# EAGLE design Speedy V2.1 (EAGLE 9.5.2)

## Sheet 1 of 4: Power
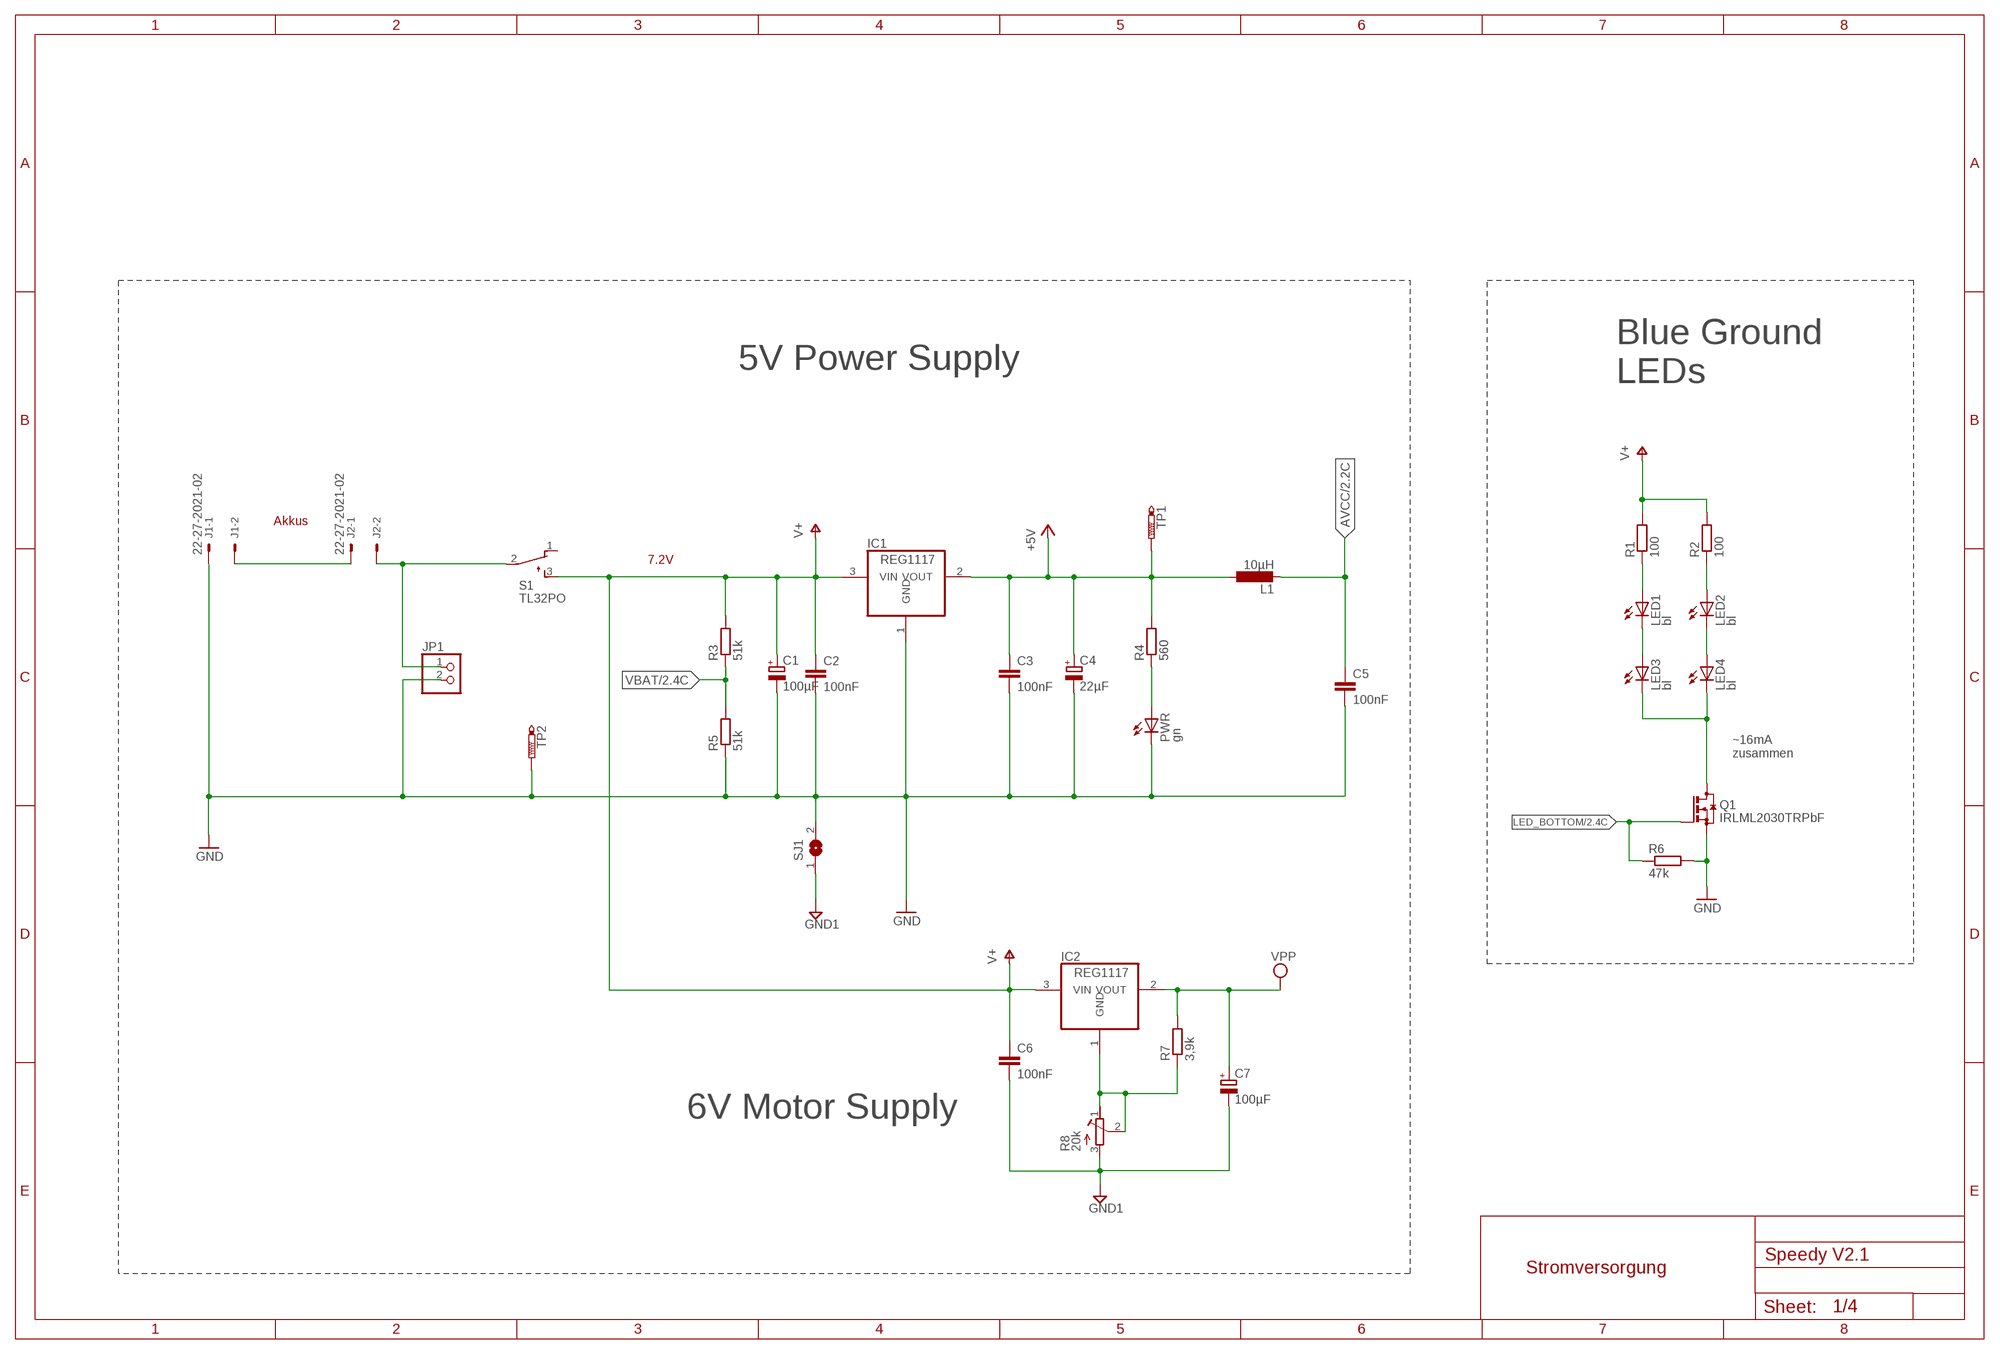
[diagram p0: schematic, sheet 1]

### Parts
C1  100µF  CPOL-EUD  [PANASONIC_D]
C2  100nF  C-EUC0805  [C0805]
C3  100nF  C-EUC0805  [C0805]
C4  22µF  CPOL-EUB  [PANASONIC_B]
C5  100nF  C-EUC0805  [C0805]
C6  100nF  C-EUC0805  [C0805]
C7  100µF  CPOL-EUD  [PANASONIC_D]
IC1  REG1117  [SOT223]
IC2  REG1117  [SOT223]
J1  22-27-2021-02  [6410-02]
J2  22-27-2021-02  [6410-02]
JP1  PINHD-1X2  [1X02]
L1  10µH  L-1210  [C1210K]
LED1  bl  LEDCHIPLED_0805  [CHIPLED_0805]
LED2  bl  LEDCHIPLED_0805  [CHIPLED_0805]
LED3  bl  LEDCHIPLED_0805  [CHIPLED_0805]
LED4  bl  LEDCHIPLED_0805  [CHIPLED_0805]
PWR  gn  LEDCHIPLED_0805  [CHIPLED_0805]
Q1  IRLML2030TRPbF  BSS123  [SOT23]
R1  100  R-EU_R0805  [R0805]
R2  100  R-EU_R0805  [R0805]
R3  51k  R-EU_R0805  [R0805]
R4  560  R-EU_R0805  [R0805]
R5  51k  R-EU_R0805  [R0805]
R6  47k  R-EU_R0805  [R0805]
R7  3,9k  R-EU_R0805  [R0805]
R8  20k  R-TRIMM3314G  [RTRIM3314G]
S1  TL32PO  [TL3XPO]
SJ1  SJ  [SJ]
TP1  PTR1B1,27  [B1,27]
TP2  PTR1PAD1-13  [P1-13]

### Nets
+5V [Supply]: C3.1 C4.+ IC1.2(VOUT) L1.1 R4.2 TP1.TP ; also sheet 2,3,4
AVCC: C5.1 L1.2 ; also sheet 2
GND [Supply]: C1.- C2.2 C3.2 C4.- C5.2 IC1.1(GND) J1.1 JP1.2 PWR.C Q1.2(S) R5.1 R6.2 SJ1.2 TP2.TP ; also sheet 2,3,4
GND1 [Supply]: C6.2 C7.- R8.3(A) SJ1.1 ; also sheet 4
LED_BOTTOM: Q1.1(G) R6.1 ; also sheet 2
N$1 [Supply]: J1.2 J2.1
N$3: PWR.A R4.1
N$11: J2.2 JP1.1 S1.2(P)
N$13: LED3.C LED4.C Q1.3(D)
N$29: LED1.A R1.1
N$30: LED1.C LED3.A
N$32: LED2.C LED4.A
N$33: LED2.A R2.1
N$35: IC2.1(GND) R7.1 R8.1(E) R8.2(S)
V+ [Supply]: C1.+ C2.1 C6.1 IC1.3(VIN) IC2.3(VIN) R1.2 R2.2 R3.2 S1.3(S) ; also sheet 2
VBAT: R3.1 R5.2 ; also sheet 2
VPP: C7.+ IC2.2(VOUT) R7.2 ; also sheet 4
Unconnected: S1.1(O)

### Notes on the sheet
- 5V Power Supply
- Blue Ground 
  LEDs
- Akkus
- 7.2V
- ~16mA
  zusammen
- 6V Motor Supply
- Stromversorgung

## Sheet 2 of 4: Controller
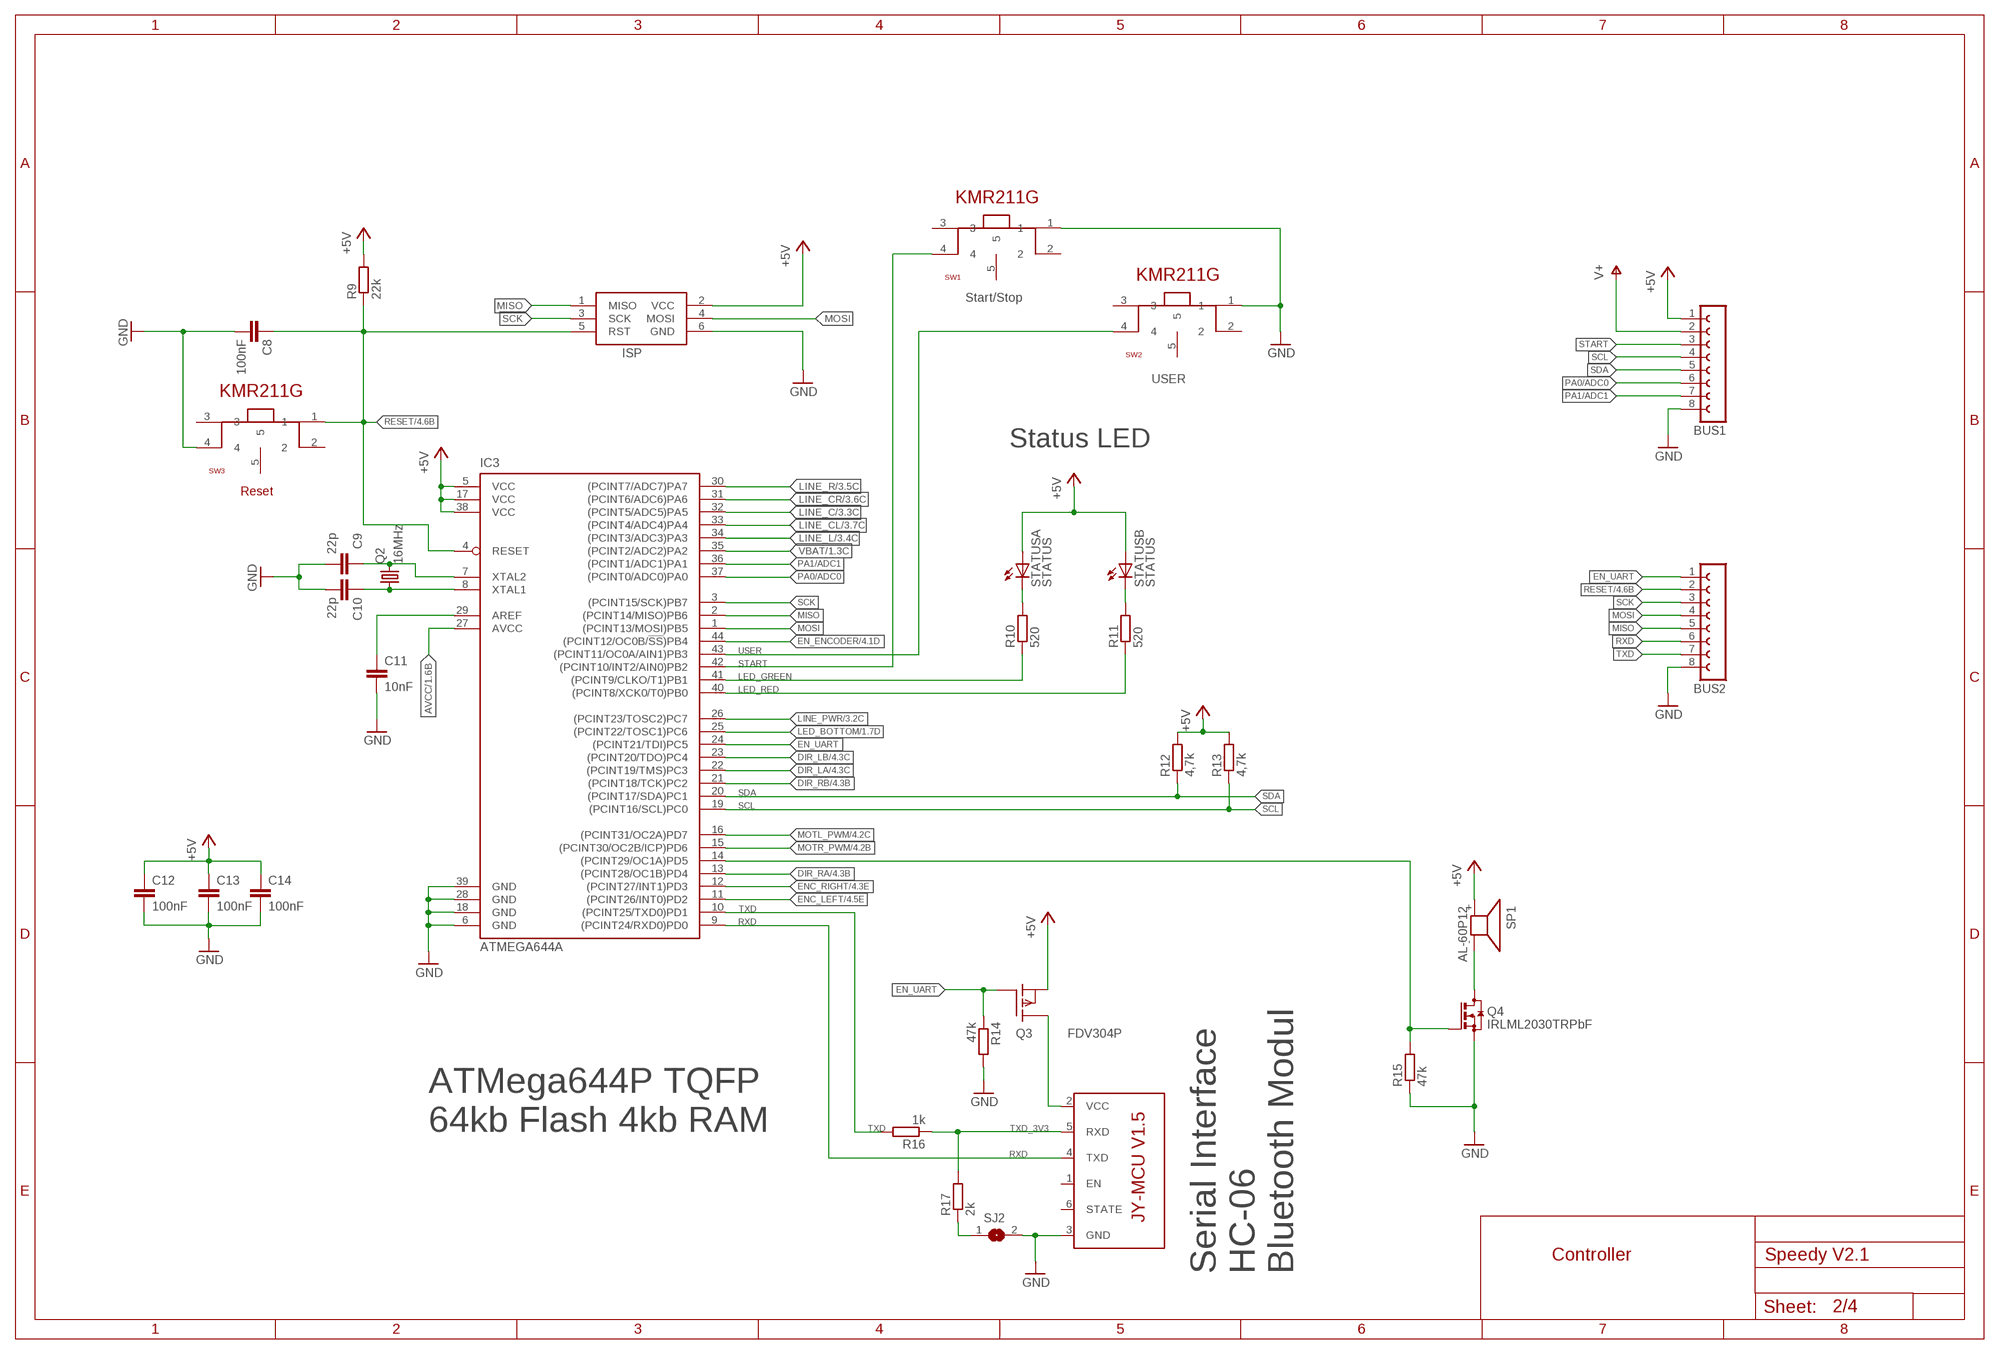
[diagram p1: schematic, sheet 2]

### Parts
BUS1  FE08-1  [FE08]
BUS2  FE08-1  [FE08]
C8  100nF  C-EUC0805  [C0805]
C9  22p  C-EUC0603  [C0603]
C10  22p  C-EUC0603  [C0603]
C11  10nF  C-EUC0603  [C0603]
C12  100nF  C-EUC0603  [C0603]
C13  100nF  C-EUC0603  [C0603]
C14  100nF  C-EUC0603  [C0603]
IC3  ATMEGA644A  [TQFP44]
ISP  AVRISP-6  [AVRISP]
Q2  16MHz  7X5MMMQ  [7X5MMQUARZ]
Q3  FDV304P  [SOT23]
Q4  IRLML2030TRPbF  BSS123  [SOT23]
R9  22k  R-EU_R0805  [R0805]
R10  520  R-EU_R0805  [R0805]
R11  520  R-EU_R0805  [R0805]
R12  4,7k  R-EU_R0805  [R0805]
R13  4,7k  R-EU_R0805  [R0805]
R14  47k  R-EU_R0805  [R0805]
R15  47k  R-EU_R0805  [R0805]
R16  1k  R-EU_R0805  [R0805]
R17  2k  R-EU_R0805  [R0805]
SJ2  SJ  [SJ]
SP1  AL-60P12  KSS1201  [KSS1201]
STATUS  STATUS  LSG-T676  [P-LCC4-0]
SW1  KMR211G_SWITCH  [KMR211G_SWITCH]
SW2  KMR211G_SWITCH  [KMR211G_SWITCH]
SW3  KMR211G_SWITCH  [KMR211G_SWITCH]
U1  BT_BOARD  [BT_BOARD]

### Nets
+5V [Supply]: BUS1.1 C12.1 C13.1 C14.1 IC3.5(VCC) IC3.17(VCC) IC3.38(VCC) ISP.2(VCC) Q3.S R9.2 R12.2 R13.2 SP1.+ STATUS.2(A:A) STATUS.4(B:A) ; also sheet 1,3,4
AVCC: IC3.27(AVCC) ; also sheet 1
BUZZER: IC3.14((PCINT29/OC1A)PD5) Q4.1(G) R15.2
DIR_LA: IC3.22((PCINT19/TMS)PC3) ; also sheet 4
DIR_LB: IC3.23((PCINT20/TDO)PC4) ; also sheet 4
DIR_RA: IC3.13((PCINT28/OC1B)PD4) ; also sheet 4
DIR_RB: IC3.21((PCINT18/TCK)PC2) ; also sheet 4
EN_ENCODER: IC3.44((PCINT12/OC0B/!SS!)PB4) ; also sheet 4
EN_UART: BUS2.1 IC3.24((PCINT21/TDI)PC5) Q3.G R14.1
ENC_LEFT: IC3.11((PCINT26/INT0)PD2) ; also sheet 4
ENC_RIGHT: IC3.12((PCINT27/INT1)PD3) ; also sheet 4
GND [Supply]: BUS1.8 BUS2.8 C8.2 C9.2 C10.2 C11.2 C12.2 C13.2 C14.2 IC3.6(GND) IC3.18(GND) IC3.28(GND) IC3.39(GND) ISP.6(GND) Q4.2(S) R14.2 R15.1 SJ2.2 SW1.1 SW2.1 SW3.4 U1.3(GND) ; also sheet 1,3,4
LED_BOTTOM: IC3.25((PCINT22/TOSC1)PC6) ; also sheet 1
LED_GREEN: IC3.41((PCINT9/CLKO/T1)PB1) R10.1
LED_RED: IC3.40((PCINT8/XCK0/T0)PB0) R11.1
LINE_C: IC3.32((PCINT5/ADC5)PA5) ; also sheet 3
LINE_CL: IC3.33((PCINT4/ADC4)PA4) ; also sheet 3
LINE_CR: IC3.31((PCINT6/ADC6)PA6) ; also sheet 3
LINE_L: IC3.34((PCINT3/ADC3)PA3) ; also sheet 3
LINE_PWR: IC3.26((PCINT23/TOSC2)PC7) ; also sheet 3
LINE_R: IC3.30((PCINT7/ADC7)PA7) ; also sheet 3
MISO: BUS2.5 IC3.2((PCINT14/MISO)PB6) ISP.1(MISO)
MOSI: BUS2.4 IC3.1((PCINT13/MOSI)PB5) ISP.4(MOSI)
MOTL_PWM: IC3.16((PCINT31/OC2A)PD7) ; also sheet 4
MOTR_PWM: IC3.15((PCINT30/OC2B/ICP)PD6) ; also sheet 4
N$5: Q4.3(D) SP1.-
N$6: R10.2 STATUS.1(A:C)
N$15: C11.1 IC3.29(AREF)
N$17: R17.1 SJ2.1
N$18: R11.2 STATUS.3(B:C)
N$20 [Supply]: Q3.D U1.2(VCC)
N$27: C9.1 IC3.7(XTAL2) Q2.P$3
N$28: C10.1 IC3.8(XTAL1) Q2.P$1
PA0/ADC0: BUS1.6 IC3.37((PCINT0/ADC0)PA0)
PA1/ADC1: BUS1.7 IC3.36((PCINT1/ADC1)PA1)
RESET: BUS2.2 C8.1 IC3.4(RESET) ISP.5(RST) R9.1 SW3.1 ; also sheet 4
RXD: BUS2.6 IC3.9((PCINT24/RXD0)PD0) U1.4(TXD)
SCK: BUS2.3 IC3.3((PCINT15/SCK)PB7) ISP.3(SCK)
SCL: BUS1.4 IC3.19((PCINT16/SCL)PC0) R13.1
SDA: BUS1.5 IC3.20((PCINT17/SDA)PC1) R12.1
START: BUS1.3 IC3.42((PCINT10/INT2/AIN0)PB2) SW1.4
TXD: BUS2.7 IC3.10((PCINT25/TXD0)PD1) R16.2
TXD_3V3: R16.1 R17.2 U1.5(RXD)
USER: IC3.43((PCINT11/OC0A/AIN1)PB3) SW2.4
V+ [Supply]: BUS1.2 ; also sheet 1
VBAT: IC3.35((PCINT2/ADC2)PA2) ; also sheet 1
Unconnected: SW1.2 SW1.3 SW1.5 SW2.2 SW2.3 SW2.5 SW3.2 SW3.3 SW3.5 U1.1(EN) U1.6(STATE)

### Notes on the sheet
- Start/Stop
- USER
- Status LED
- Reset
- ATMega644P TQFP
  64kb Flash 4kb RAM
- Controller
- Serial Interface
  HC-06 
  Bluetooth Modul

## Sheet 3 of 4: Sensors
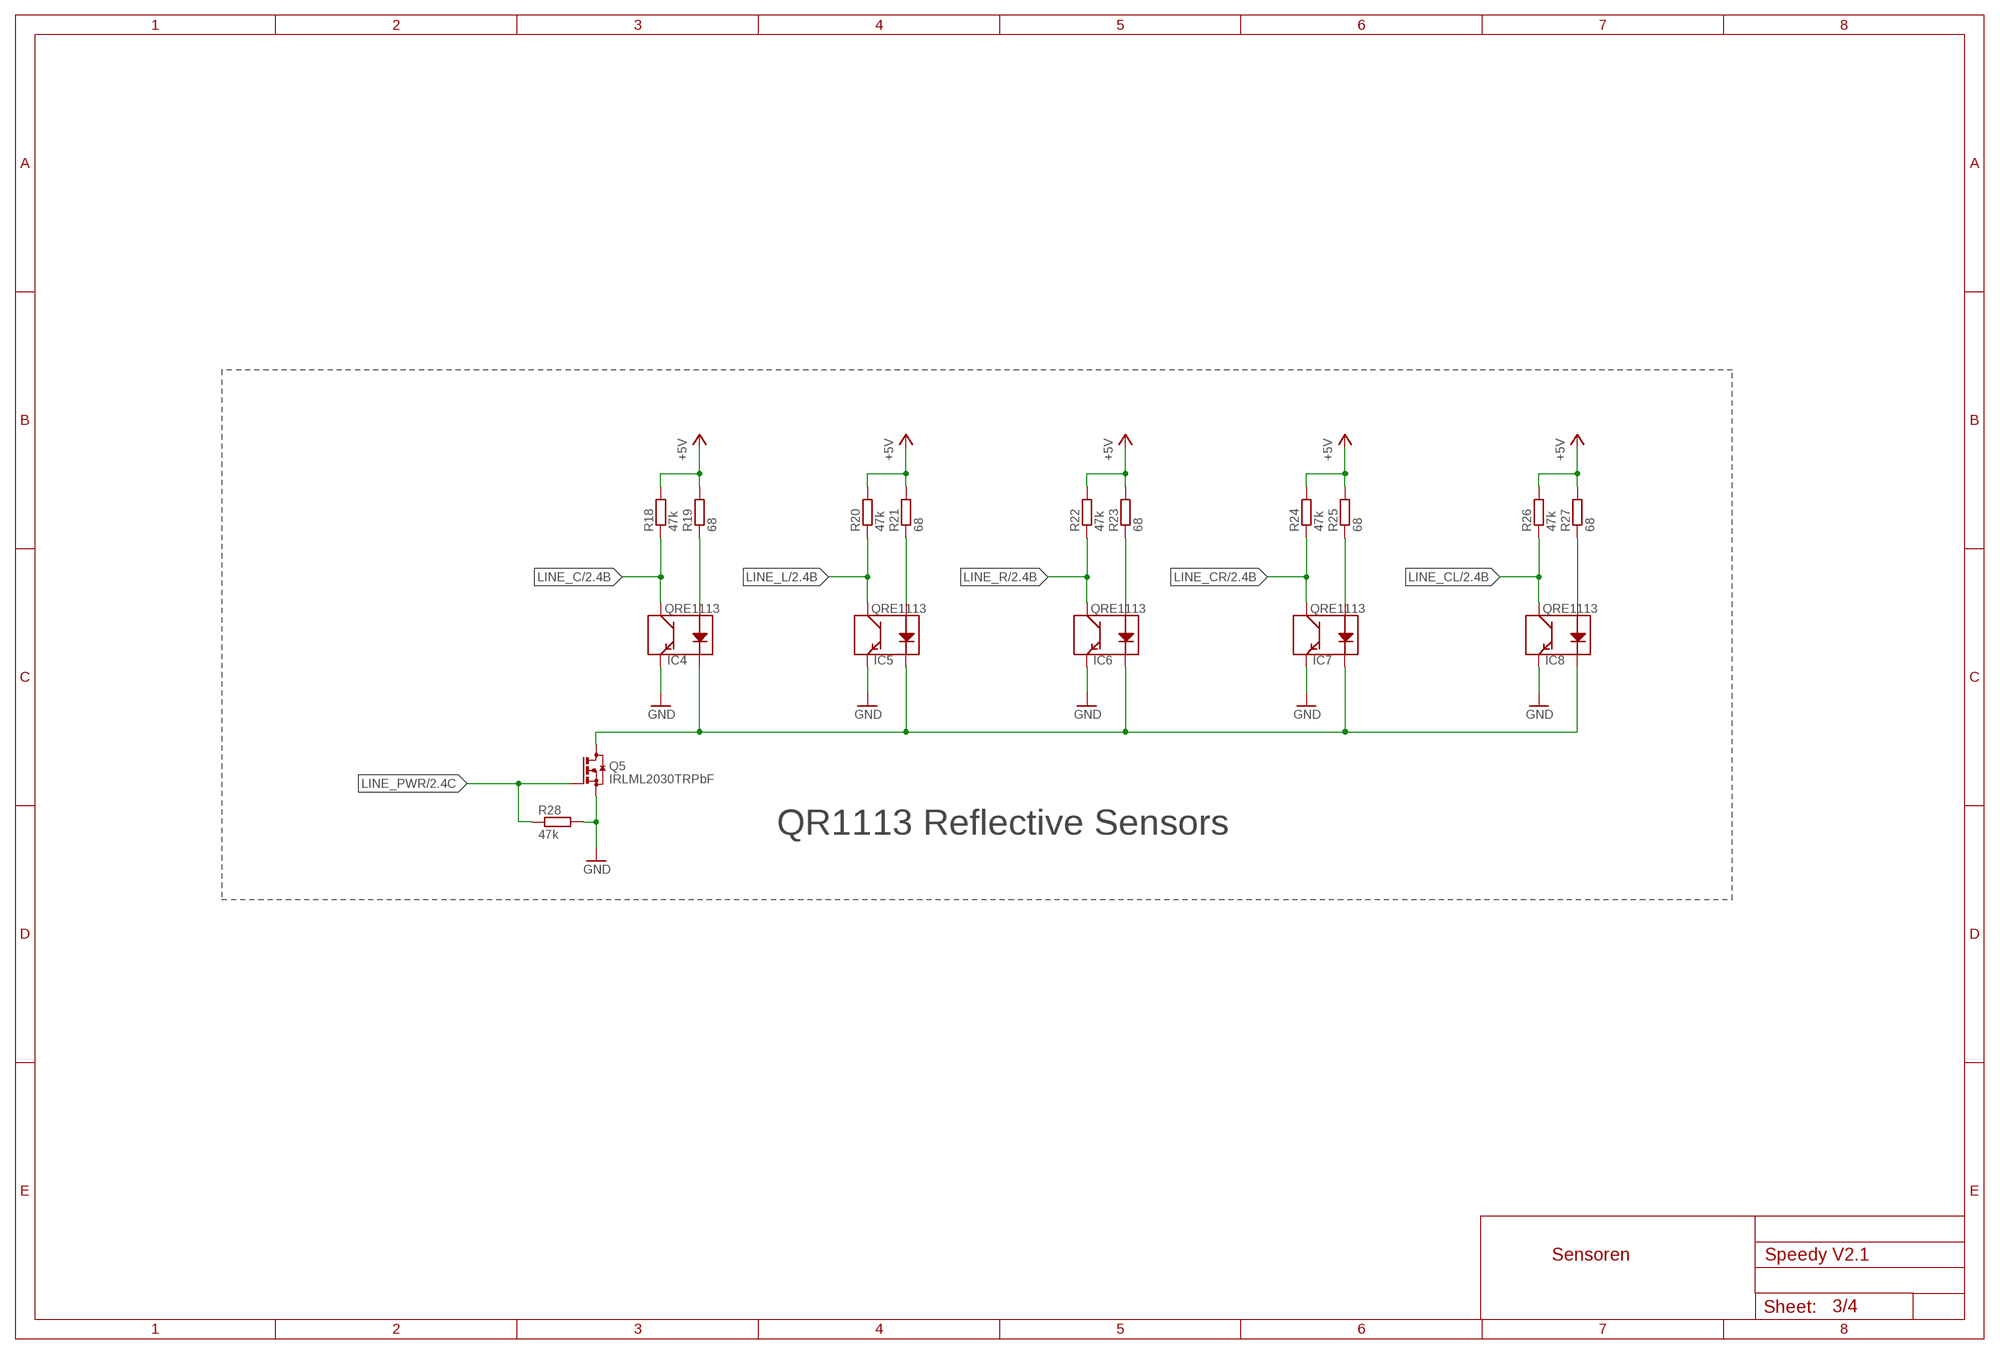
[diagram p2: schematic, sheet 3]

### Parts
IC4  QRE1113  [QRE1113]
IC5  QRE1113  [QRE1113]
IC6  QRE1113  [QRE1113]
IC7  QRE1113  [QRE1113]
IC8  QRE1113  [QRE1113]
Q5  IRLML2030TRPbF  BSS123  [SOT23]
R18  47k  R-EU_R0805  [R0805]
R19  68  R-EU_R0805  [R0805]
R20  47k  R-EU_R0805  [R0805]
R21  68  R-EU_R0805  [R0805]
R22  47k  R-EU_R0805  [R0805]
R23  68  R-EU_R0805  [R0805]
R24  47k  R-EU_R0805  [R0805]
R25  68  R-EU_R0805  [R0805]
R26  47k  R-EU_R0805  [R0805]
R27  68  R-EU_R0805  [R0805]
R28  47k  R-EU_R0805  [R0805]

### Nets
+5V [Supply]: R18.2 R19.2 R20.2 R21.2 R22.2 R23.2 R24.2 R25.2 R26.2 R27.2 ; also sheet 1,2,4
GND [Supply]: IC4.4(E) IC5.4(E) IC6.4(E) IC7.4(E) IC8.4(E) Q5.2(S) R28.2 ; also sheet 1,2,4
LINE_C: IC4.3(C) R18.1 ; also sheet 2
LINE_CL: IC8.3(C) R26.1 ; also sheet 2
LINE_CR: IC7.3(C) R24.1 ; also sheet 2
LINE_L: IC5.3(C) R20.1 ; also sheet 2
LINE_PWR: Q5.1(G) R28.1 ; also sheet 2
LINE_R: IC6.3(C) R22.1 ; also sheet 2
N$4: IC4.2(K) IC5.2(K) IC6.2(K) IC7.2(K) IC8.2(K) Q5.3(D)
N$10: IC5.1(A) R21.1
N$37: IC4.1(A) R19.1
N$40: IC6.1(A) R23.1
N$42: IC7.1(A) R25.1
N$43: IC8.1(A) R27.1

### Notes on the sheet
- QR1113 Reflective Sensors
- Sensoren

## Sheet 4 of 4: Motors
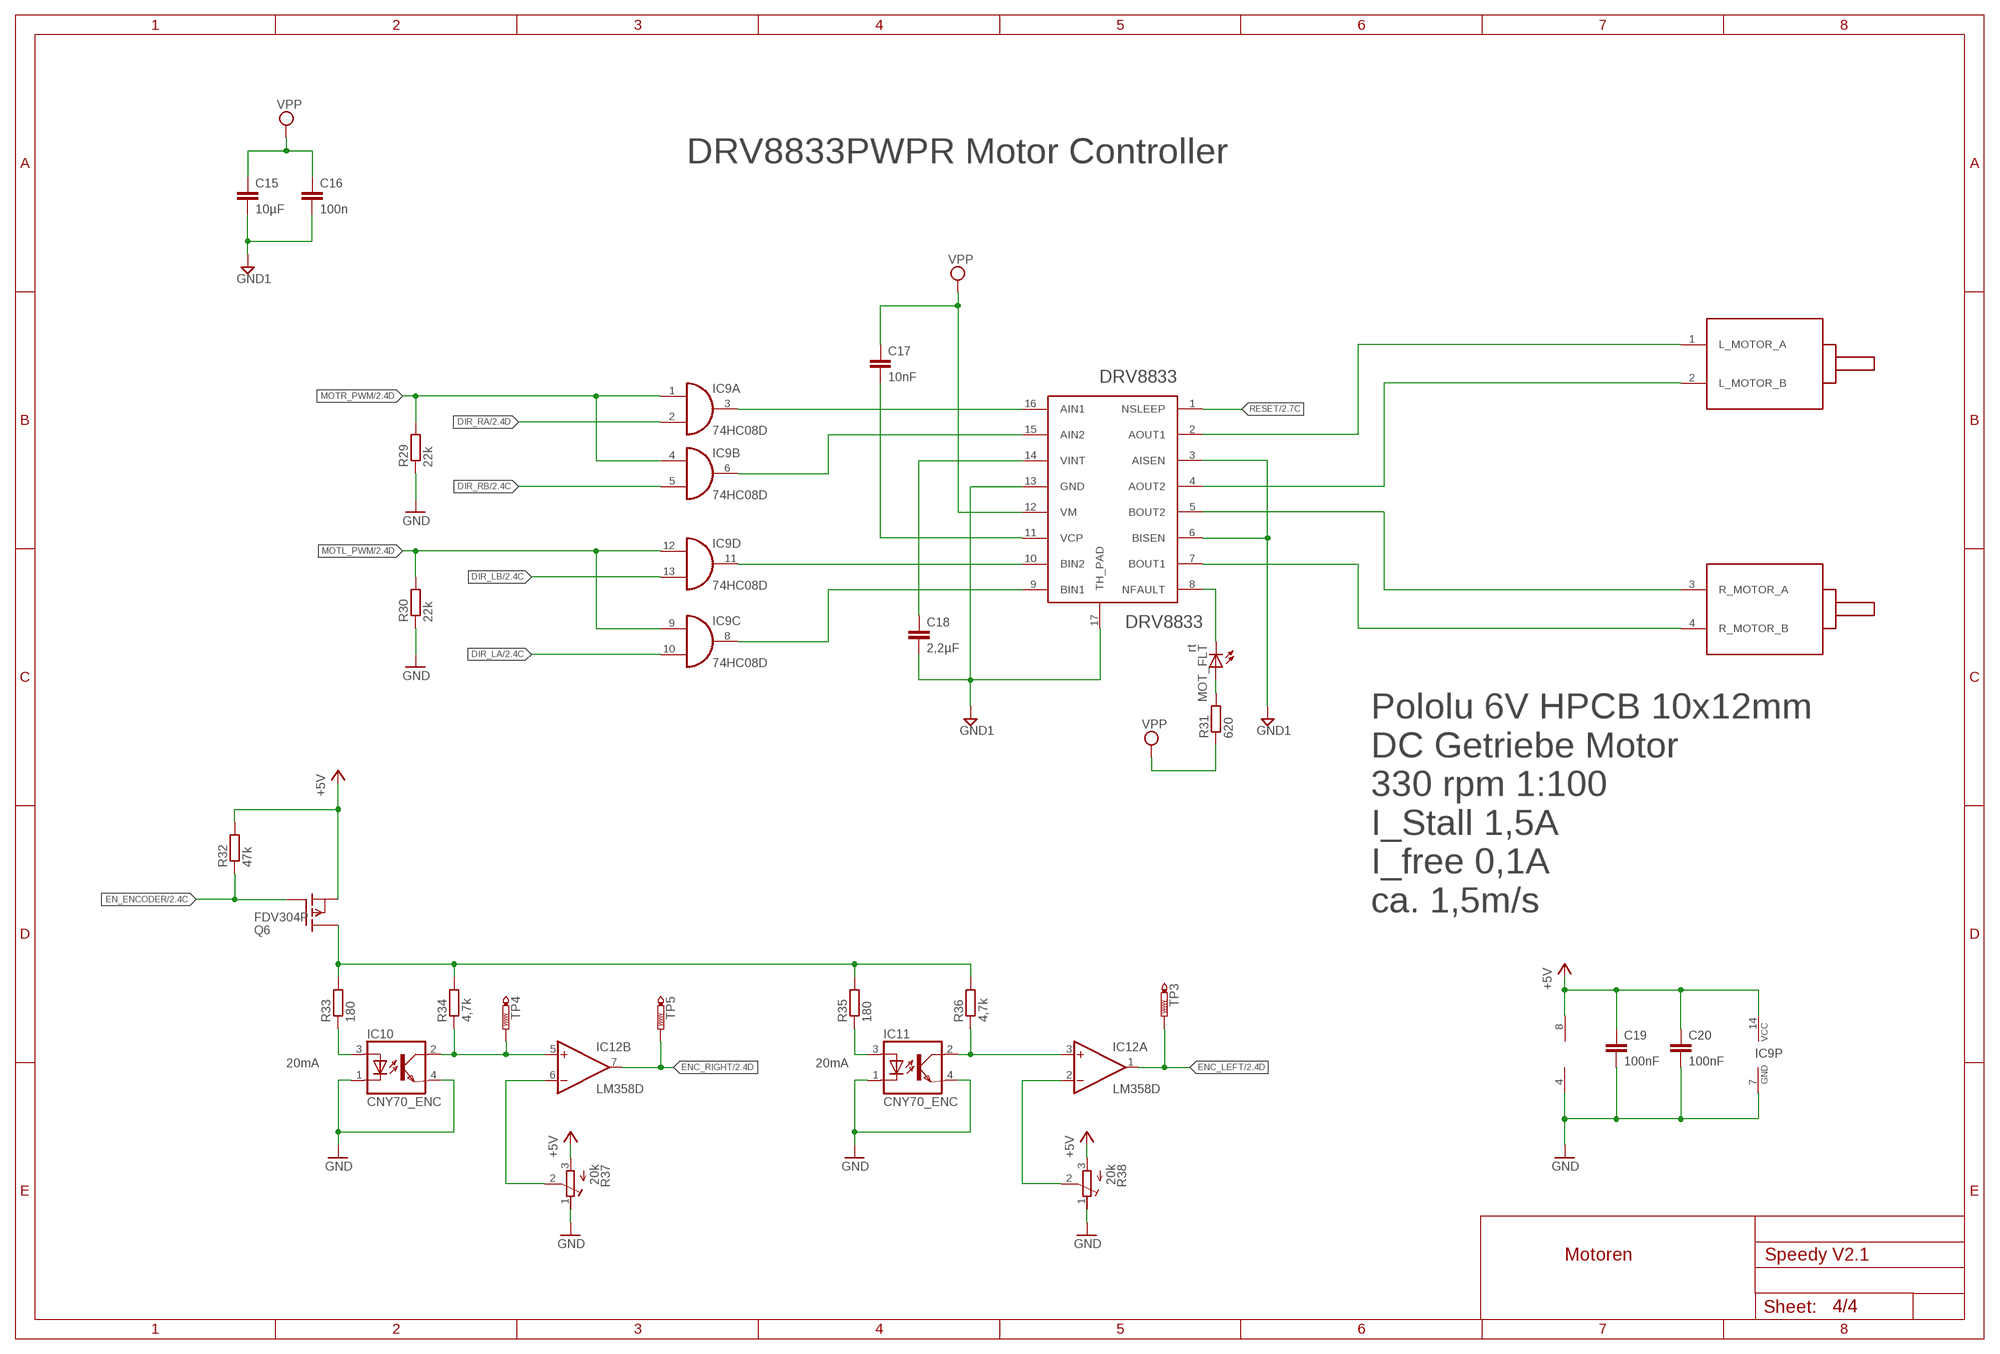
[diagram p3: schematic, sheet 4]

### Parts
C15  10µF  C-EUC1206  [C1206]
C16  100n  C-EUC0805  [C0805]
C17  10nF  C-EUC0805  [C0805]
C18  2,2µF  C-EUC1206  [C1206]
C19  100nF  C-EUC0805  [C0805]
C20  100nF  C-EUC0805  [C0805]
IC9  74HC08D  [SO14]
IC10  CNY70_ENC  [CNY70_ENC]
IC11  CNY70_ENC  [CNY70_ENC]
IC12  LM358D  [SO08]
MOT_FLT  rt  LEDCHIP-LED0805  [CHIP-LED0805]
Q6  FDV304P  [SOT23]
R29  22k  R-EU_R0805  [R0805]
R30  22k  R-EU_R0805  [R0805]
R31  620  R-EU_R0805  [R0805]
R32  47k  R-EU_R0805  [R0805]
R33  180  R-EU_R0805  [R0805]
R34  4,7k  R-EU_R0805  [R0805]
R35  180  R-EU_R0805  [R0805]
R36  4,7k  R-EU_R0805  [R0805]
R37  20k  R-TRIMM3314G  [RTRIM3314G]
R38  20k  R-TRIMM3314G  [RTRIM3314G]
TP3  PTR1B1,27  [B1,27]
TP4  PTR1B1,27  [B1,27]
TP5  PTR1B1,27  [B1,27]
U2  DRV8833  [SOP65P640X120-17N]
U$1  SPEEDY_MOTOR_MOUNT  [FUTURA_V1.0_MOTOT_MOUNT]

### Nets
+5V [Supply]: C19.1 C20.1 IC9.14(P:VCC) IC12.8(P:V+) Q6.S R32.2 R37.3(A) R38.3(A) ; also sheet 1,2,3
DIR_LA: IC9.10(C:I1) ; also sheet 2
DIR_LB: IC9.13(D:I1) ; also sheet 2
DIR_RA: IC9.2(A:I1) ; also sheet 2
DIR_RB: IC9.5(B:I1) ; also sheet 2
EN_ENCODER: Q6.G R32.1 ; also sheet 2
ENC_LEFT: IC12.1(A:OUT) TP3.TP ; also sheet 2
ENC_RIGHT: IC12.7(B:OUT) TP5.TP ; also sheet 2
GND [Supply]: C19.2 C20.2 IC9.7(P:GND) IC10.1(CATH.) IC10.4(E) IC11.1(CATH.) IC11.4(E) IC12.4(P:V-) R29.1 R30.1 R37.1(E) R38.1(E) ; also sheet 1,2,3
GND1 [Supply]: C15.2 C16.2 C18.2 U2.3(AISEN) U2.6(BISEN) U2.13(GND) U2.17(TH_PAD) ; also sheet 1
MOTL_PWM: IC9.9(C:I0) IC9.12(D:I0) R30.2 ; also sheet 2
MOTR_PWM: IC9.1(A:I0) IC9.4(B:I0) R29.2 ; also sheet 2
N$7: C18.1 U2.14(VINT)
N$8: C17.2 U2.11(VCP)
N$9: IC11.3(A) R35.1
N$12: IC11.2(COL) IC12.3(A:+IN) R36.1
N$14: IC10.3(A) R33.1
N$16: U2.5(BOUT2) U$1.3(R_MOTOR_A)
N$21: MOT_FLT.A R31.2
N$22: MOT_FLT.C U2.8(NFAULT)
N$23: IC9.3(A:O) U2.16(AIN1)
N$24: IC9.6(B:O) U2.15(AIN2)
N$25: IC9.11(D:O) U2.10(BIN2)
N$26: IC9.8(C:O) U2.9(BIN1)
N$31: IC10.2(COL) IC12.5(B:+IN) R34.1 TP4.TP
N$36: IC12.6(B:-IN) R37.2(S)
N$38: U2.7(BOUT1) U$1.4(R_MOTOR_B)
N$39: U2.4(AOUT2) U$1.2(L_MOTOR_B)
N$41: U2.2(AOUT1) U$1.1(L_MOTOR_A)
N$44: IC12.2(A:-IN) R38.2(S)
N$47: Q6.D R33.2 R34.2 R35.2 R36.2
RESET: U2.1(NSLEEP) ; also sheet 2
VPP: C15.1 C16.1 C17.1 R31.1 U2.12(VM) ; also sheet 1

### Notes on the sheet
- DRV8833PWPR Motor Controller
- Pololu 6V HPCB 10x12mm 
  DC Getriebe Motor
  330 rpm 1:100
  I_Stall 1,5A
  I_free 0,1A
  ca. 1,5m/s
- 20mA | 20mA
- Motoren

## Library data of the parts
BUS1 BUS2 = con-lsta:FE08-1: FEMALE HEADER; OC_FARNELL: unknown; OC_NEWARK: unknown
C1 C4 C7 = rcl:CPOL-EU: POLARIZED CAPACITOR, European symbol
C2 C3 C5 C6 C8-C20 = rcl:C-EU: CAPACITOR, European symbol
IC1 IC2 = burr-brown:REG1117: 800mA and 1A Low Dropout (LDO) Positive Regulator 1.8V, 2.5V, 2.85V, 3.3V, 5V, and Adj; MPN: REG1117; OC_FARNELL: 1097566; OC_NEWARK: 14P6981
IC3 = atmel:ATMEGA644: 8-bit Microcontroller with 64K Bytes In-System Programmable Flash Source: http://www.atmel.com/dyn/resources/prod_documents/doc2593.pdf; MPN: ATMEGA644PV-10AU; OC_FARNELL: 1455123; OC_NEWARK: 58M3748
IC4-IC8 = Testing:QRE1113
IC9 = 74xx-eu:74*08: Quad 2-input AND gate
IC10 IC11 = CNY70_Encoder:CNY70_ENC
IC12 = linear:LM358: OP AMP also LM158; LM258; LM2904 Source: http://cache.national.com/ds/LM/LM158.pdf
ISP = adafruit:AVRISP: AVR ISP HEADER Standard 6 pin header for AVR programming
J1 J2 = con-molex:22-?-02: CONNECTOR wire to board 2.54 mm (.1 inch) pitch header; OC_FARNELL: unknown; OC_NEWARK: unknown
JP1 = pinhead:PINHD-1X2: PIN HEADER
L1 = Induktor-1210:L-1210
LED1-LED4 MOT_FLT PWR = led:LED: LED OSRAM: - CHIPLED LG R971, LG N971, LY N971, LG Q971, LY Q971, LO R971, LY R971 LH N974, LH R974 LS Q976, LO Q976, LY Q976 LO Q996 - Hyper CHIPLED LW Q18S LB Q993, LB Q99A, LB R99A - SideLED LS A670, LO A670, LY A670, LG A670, LP A670 LB A673, LV A673, LT A673, LW A673 LH A674 LY A675 LS A676, LA A676, LO A676, LY A676, LW A676 LS A679, LY A679, LG A679 - Hyper Micro SIDELED® LS Y876, LA Y876, LO Y876, LY Y876 LT Y87S - SmartLED LW L88C, LW L88S LB L89C, LB L89S, LG L890 LS L89K, LO L89K, LY L89K LS L896, LA L896, LO L896, LY L896 - TOPLED LS T670, LO T670, LY T670, LG T670, LP T670 LSG T670, LSP T670, LSY T670, LOP T670, LYG T670 LG T671, LOG T671, LSG T671 LB T673, LV T673, LT T673, LW T673 LH T674 LS T676, LA T676, LO T676, LY T676, LB T676, LH T676, LSB T676, LW T676 LB T67C, LV T67C, LT T67C, LS T67K, LO T67K, LY T67K, LW E67C LS E67B, LA E67B, LO E67B, LY E67B, LB E67C, LV E67C, LT E67C LW T67C LS T679, LY T679, LG T679 LS T770, LO T770, LY T770, LG T770, LP T770 LB T773, LV T773, LT T773, LW T773 LH T774 LS E675, LA E675, LY E675, LS T675 LS T776, LA T776, LO T776, LY T776, LB T776 LHGB T686 LT T68C, LB T68C - Hyper Mini TOPLED® LB M676 - Mini TOPLED Santana® LG M470 LS M47K, LO M47K, LY M47K Source: http://www.osram.convergy.de LUXEON: - LUMILED® LXK2-PW12-R00, LXK2-PW12-S00, LXK2-PW14-U00, LXK2-PW14-V00 LXK2-PM12-R00, LXK2-PM12-S00, LXK2-PM14-U00 LXK2-PE12-Q00, LXK2-PE12-R00, LXK2-PE12-S00, LXK2-PE14-T00, LXK2-PE14-U00 LXK2-PB12-K00, LXK2-PB12-L00, LXK2-PB12-M00, LXK2-PB14-N00, LXK2-PB14-P00, LXK2-PB14-Q00 LXK2-PR12-L00, LXK2-PR12-M00, LXK2-PR14-Q00, LXK2-PR14-R00 LXK2-PD12-Q00, LXK2-PD12-R00, LXK2-PD12-S00 LXK2-PH12-R00, LXK2-PH12-S00 LXK2-PL12-P00, LXK2-PL12-Q00, LXK2-PL12-R00 Source: www.luxeon.com KINGBRIGHT: KA-3528ASYC Source: www.kingbright.com
Q1 Q4 Q5 = transistor-small-signal:BSS123: N-CHANNEL MOS FET
Q2 = Quarz-SMD:7X5MMMQ
Q3 Q6 = MOSFET-PChannel:FDV304P
R1-R7 R9-R36 = rcl:R-EU_: RESISTOR, European symbol
R8 R37 R38 = rcl:R-TRIMM: Trimm resistor
S1 = switch:TL32PO: TINY SWITCH ON - MOM Source: http://www2.produktinfo.conrad.com/datenblaetter/700000-724999/705152-da-01-de-Subminiaturschalter_TL_36YO.pdf
SJ1 SJ2 = jumper:SJ: SMD solder JUMPER
SP1 = buzzer:KSS1201: SPEAKER Source: Schukat; OC_FARNELL: unknown; OC_NEWARK: unknown
STATUS = led:LSG-T676: LSG T676 Hyper Multi TOPLED ® Hyper-Bright LED Source: http://docs-europe.electrocomponents.com/webdocs/08c3/0900766b808c36ca.pdf
SW1-SW3 = KMR211G_SWITCH:KMR211G_SWITCH
TP1-TP5 = testpad:PTR1: TEST PIN
U1 = BT-Board_JY-MCU V1.3:BT_BOARD
U2 = DRV8833PWP:DRV8833
U$1 = Speedy motor mount:SPEEDY_MOTOR_MOUNT

## Net classes
1 Supply: width 0.3 mm

## Board
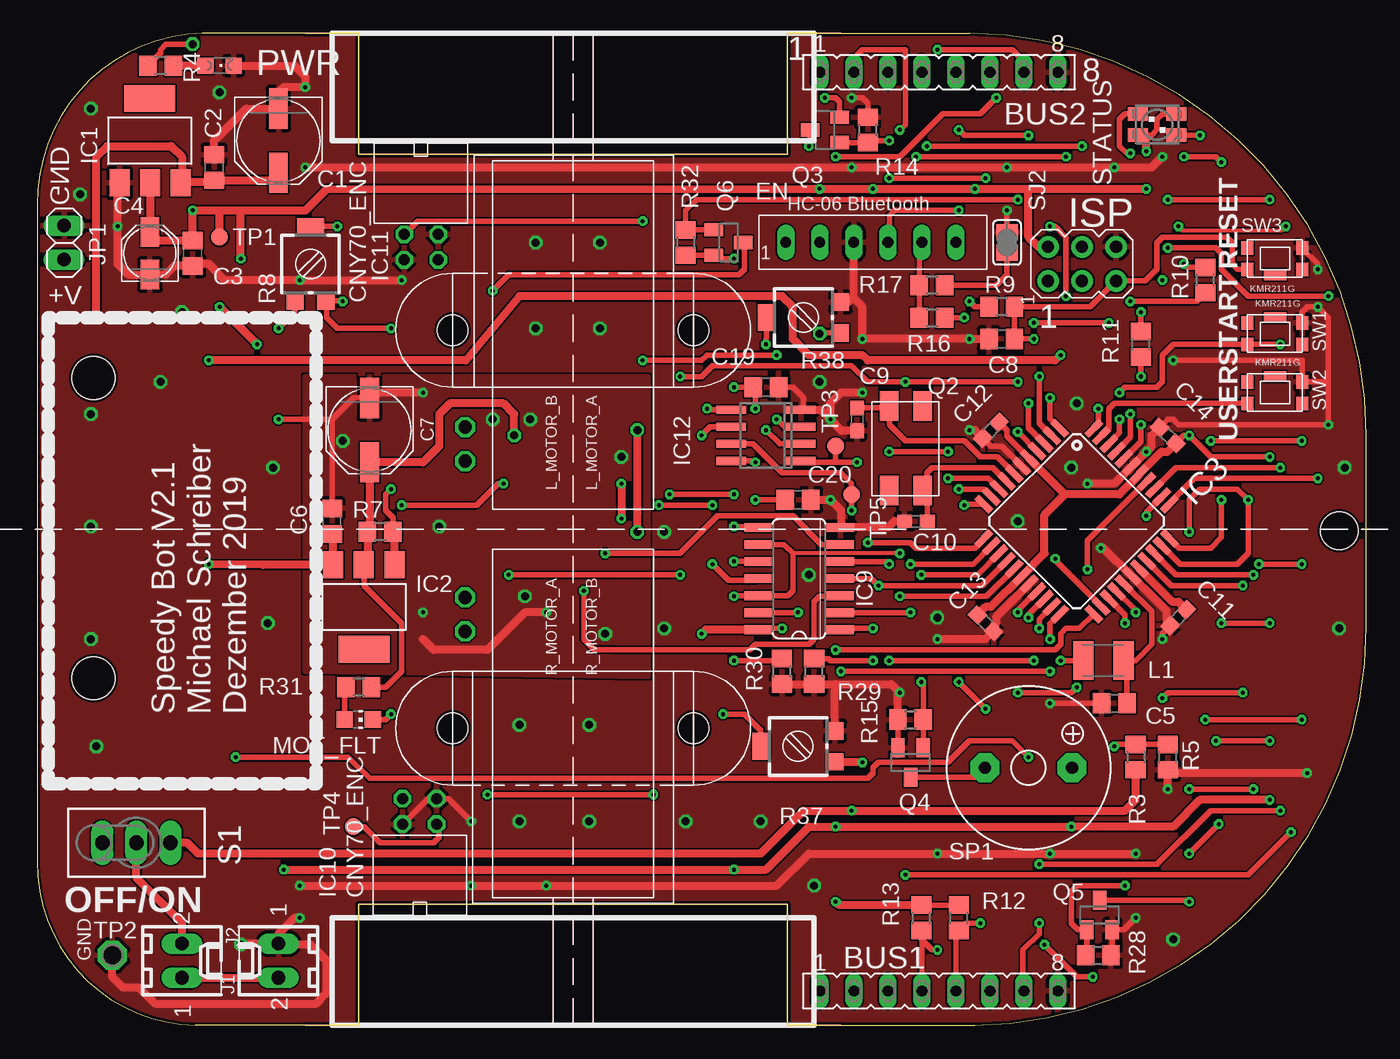
[diagram p4: board, top side]
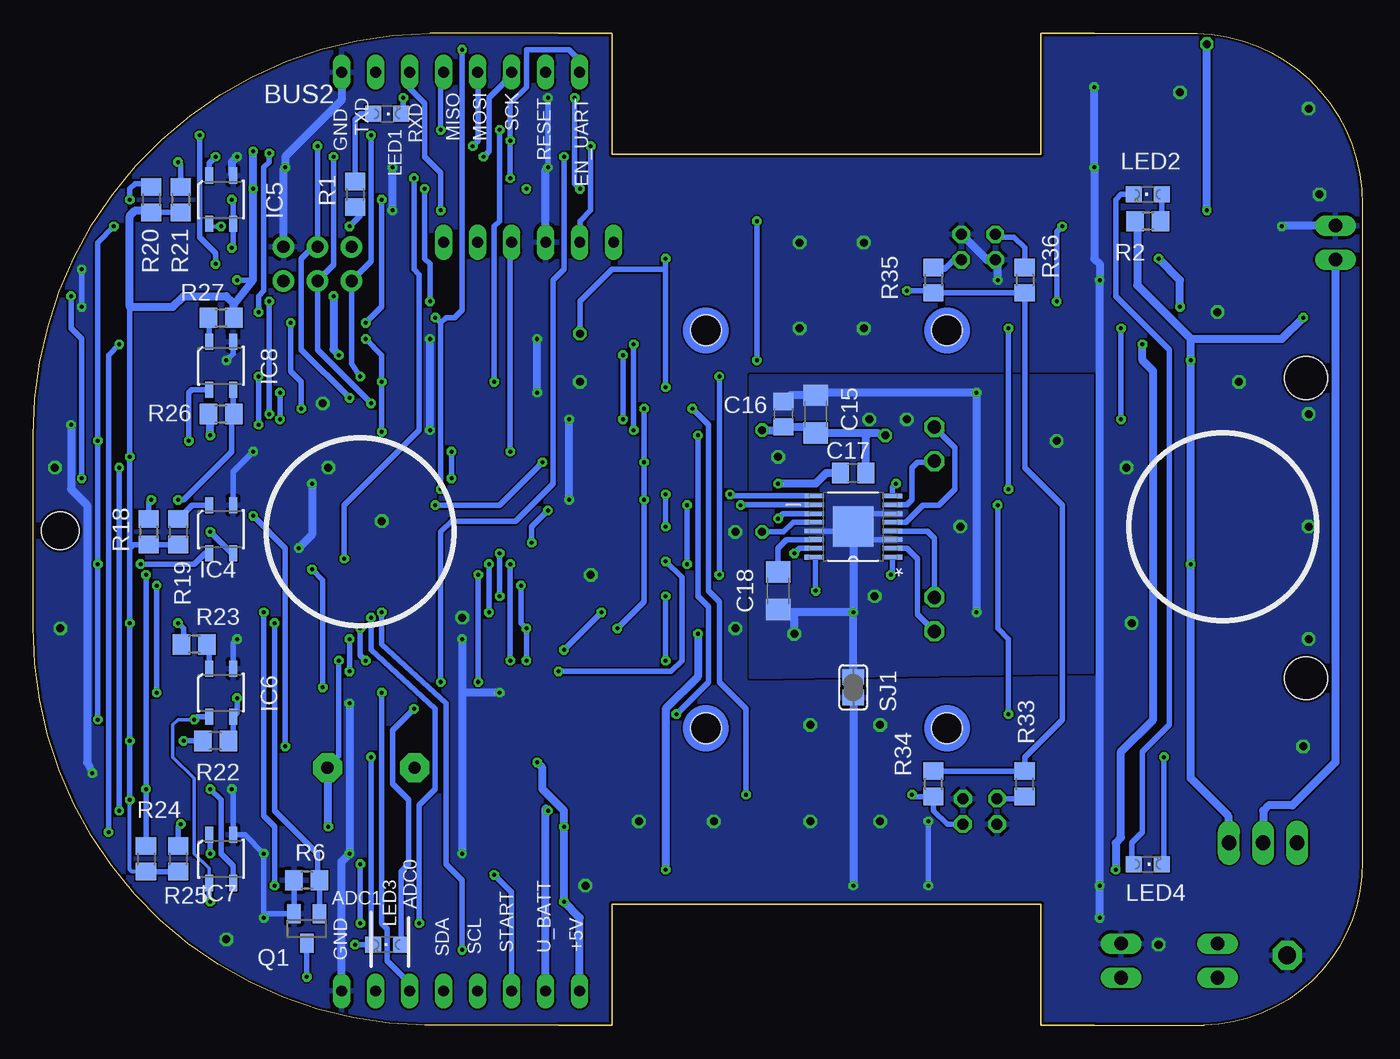
[diagram p5: board, bottom side, seen from below]

Size 99.2 x 74 mm. Coordinates in mm from the lower left corner, seen from the top.
Outline: 11.81,0 arc-90 0,12.21 0,61.19 arc-90 12.41,74
Outline: 69.92,0 arc90 99.2,29.68 99.2,44 arc90 69.6,74 59.2,74
Outline: 20.6,74 12.3,74
Outline: 20.6,0 11.8,0
Outline: 59.6,0 70,0
Copper layers (1*16): Top 0.035mm / dielectric 1.5mm / Bottom 0.035mm
Design rules "default *": minimum track width 5mil, minimum drill 0.3mm, track to track 5mil, track to pad 5mil, pad to pad 5mil, via to via 5mil, smd to smd 5mil, copper to edge 0.2mm, drill to drill 0.2mm, minimum pad ring 10mil, minimum via ring 8mil, stop-mask expansion 4mil, vias tented up to drill 0mil, thermal gap 10mil
Holes 2.8 mm at 97.2,36.89
Holes 3.2 mm at 4.2,48.29 4.2,25.89

### Footprints (pad centres in the part's own frame; a part is rotated, then mirrored left to right if it is on the bottom)
FE08 = drill 0.813 long: 1 -8.89,0; 2 -6.35,0; 3 -3.81,0; 4 -1.27,0; 5 1.27,0; 6 3.81,0; 7 6.35,0; 8 8.89,0
PANASONIC_D = smd 3 x 1.4: + 2.4,0; - -2.4,0
C0805 = smd 1.3 x 1.5: 1 -0.95,0; 2 0.95,0
PANASONIC_B = smd 2.2 x 1.4: + 1.6,0; - -1.6,0
C0603 = smd 1.1 x 1: 1 -0.85,0; 2 0.85,0
C1206 = smd 1.6 x 1.8: 1 -1.4,0; 2 1.4,0
SOT223 = smd 1.499 x 2.007: 1 -2.261,-3.15; 2 0.025,-3.15; 3 2.311,-3.15 | smd 3.81 x 2.007: 4 0,3.15
TQFP44 = smd 1.5 x 0.5: 1 -5.8,4; 2 -5.8,3.2; 3 -5.8,2.4; 4 -5.8,1.6; 5 -5.8,0.8; 6 -5.8,0; 7 -5.8,-0.8; 8 -5.8,-1.6; 9 -5.8,-2.4; 10 -5.8,-3.2; 11 -5.8,-4; 23 5.8,-4; 24 5.8,-3.2; 25 5.8,-2.4; 26 5.8,-1.6; 27 5.8,-0.8; 28 5.8,0; 29 5.8,0.8; 30 5.8,1.6; 31 5.8,2.4; 32 5.8,3.2; 33 5.8,4 | smd 0.5 x 1.5: 12 -4,-5.8; 13 -3.2,-5.8; 14 -2.4,-5.8; 15 -1.6,-5.8; 16 -0.8,-5.8; 17 0,-5.8; 18 0.8,-5.8; 19 1.6,-5.8; 20 2.4,-5.8; 21 3.2,-5.8; 22 4,-5.8; 34 4,5.8; 35 3.2,5.8; 36 2.4,5.8; 37 1.6,5.8; 38 0.8,5.8; 39 0,5.8; 40 -0.8,5.8; 41 -1.6,5.8; 42 -2.4,5.8; 43 -3.2,5.8; 44 -4,5.8
QRE1113 = smd 1.2 x 0.6: 1 -1.8,-0.9; 2 1.8,-0.9; 3 1.8,0.9; 4 -1.8,0.9
SO14 = smd 0.66 x 2.032: 1 -3.81,-3.073; 2 -2.54,-3.073; 3 -1.27,-3.073; 4 0,-3.073; 5 1.27,-3.073; 6 2.54,-3.073; 7 3.81,-3.073; 8 3.81,3.073; 9 2.54,3.073; 10 1.27,3.073; 11 0,3.073; 12 -1.27,3.073; 13 -2.54,3.073; 14 -3.81,3.073
CNY70_ENC = drill 0.8 octagon: 1 1.27,6.985; 2 3.81,6.985; 3 1.27,8.89; 4 3.81,8.89
SO08 = smd 0.6 x 2.2: 1 -1.905,-2.6; 2 -0.635,-2.6; 3 0.635,-2.6; 4 1.905,-2.6; 5 1.905,2.6; 6 0.635,2.6; 7 -0.635,2.6; 8 -1.905,2.6
AVRISP = drill 0.9 pad 1.626: 1 -1.27,2.54; 2 1.27,2.54; 3 -1.27,0; 4 1.27,0; 5 -1.27,-2.54; 6 1.27,-2.54
6410-02 = drill 1.016 long: 1 1.27,0; 2 -1.27,0
1X02 = drill 1.016 long: 1 -1.27,0; 2 1.27,0
C1210K = smd 1.5 x 2.9: 1 -1.5,0; 2 1.5,0
CHIPLED_0805 = smd 1.2 x 1.2: A 0,-1.05; C 0,1.05
CHIP-LED0805 = smd 1.2 x 1.2: A 0,-1.05; C 0,1.05
SOT23 = smd 1 x 1.4: 1 -0.95,-1.1; 2 0.95,-1.1; 3 0,1.1
7X5MMQUARZ = smd 2.2 x 1.4: P$1 1.1,0.7; P$2 7.4,0.7; P$3 7.4,3.2; P$4 1.1,3.2
SOT23' = smd 1 x 1.4: D 0,1.1; G -0.95,-1.1; S 0.95,-1.1
R0805 = smd 1.3 x 1.5: 1 -0.95,0; 2 0.95,0
RTRIM3314G = smd 1.3 x 1.3: 1 1.15,-2.75; 3 -1.15,-2.75 | smd 2 x 1.3: 2 0,2.75
TL3XPO = drill 1.1 pad 1.422 long: 1 -2.54,0; 2 0,0; 3 2.54,0
SJ = smd 1.168 x 1.6: 1 -0.762,0; 2 0.762,0
KSS1201 = drill 0.914 pad 2.159 octagon: + 3.251,0; - -3.251,0
P-LCC4-0 = smd 1 x 1.5: 1 -0.787,-1.45; 2 -0.787,1.45; 3 0.787,1.45; 4 0.787,-1.45
KMR211G_SWITCH = smd 0.9 x 1: 1 2.05,0.8; 2 2.05,-0.8; 3 -2.05,0.8; 4 -2.05,-0.8 | smd 1.7 x 0.8: 5 0,1.2
B1,27 = smd 1.27 x 1.27: TP 0,0
P1-13 = drill 1.321 pad 2.159 octagon: TP 0,0
BT_BOARD = drill 0.8 long: 1 -2.54,0; 2 0,0; 3 2.54,0; 4 5.08,0; 5 7.62,0; 6 10.16,0
SOP65P640X120-17N = smd 1.473 x 0.356: 1 -2.921,2.286; 2 -2.921,1.626; 3 -2.921,0.965; 4 -2.921,0.33; 5 -2.921,-0.33; 6 -2.921,-0.965; 7 -2.921,-1.626; 8 -2.921,-2.286; 9 2.921,-2.286; 10 2.921,-1.626; 11 2.921,-0.965; 12 2.921,-0.33; 13 2.921,0.33; 14 2.921,0.965; 15 2.921,1.626; 16 2.921,2.286 | smd 2.997 x 2.997: 17 0,0
FUTURA_V1.0_MOTOT_MOUNT = drill 1 octagon: 1 7.62,27.94; 2 5.08,27.94; 3 -7.62,27.94; 4 -5.08,27.94 | hole 2.286: 14.85,45; 14.85,27; -14.85,27; -14.85,45

### Placement (x,y rotation side)
BUS1  67.31,2.54 0 top
BUS2  67.31,71.12 0 top
C1  18,66 270 top
C2  13.2,64 90 top
C3  11.6,57.6 270 top
C4  8.4,57.6 90 top
C5  80.4,24 180 top
C6  22,37.6 90 top
C7  24.8,44.4 270 top
C8  72,51.2 180 top
C9  61.2,45.2 270 top
C10  65.6,37.6 180 top
C11  85.2,30.4 225 top
C12  71.2,44.4 225 top
C13  70.8,30 315 top
C14  84.4,44 135.7 top
C15  40.8,45.6 90 bottom
C16  43.2,45.6 90 bottom
C17  38,41.2 180 bottom
C18  43.6,32.4 270 bottom
C19  54.4,47.6 0 top
C20  56.8,39.2 0 top
IC1  8.4,66 0 top
IC2  24.4,31.2 180 top
IC3  77.6,37.6 315 top
IC4  85.2,37 270 bottom
IC5  85.2,61.6 270 bottom
IC6  85.2,24.8 270 bottom
IC7  85.2,12.4 270 bottom
IC8  85.2,49.2 270 bottom
IC9  56.87,33.32 90 top
IC10  26,8 0 top
IC11  31.2,66 180 top
IC12  54.4,44 90 top
ISP  78,56.8 90 top
J1  18,4.8 90 top
J2  10.8,4.8 270 top
JP1  2,58.4 90 top
L1  79.6,27.2 0 top
LED1  72.8,68 270 bottom
LED2  16,62 90 bottom
LED3  72.8,6 90 bottom
LED4  16,12 270 bottom
MOT_FLT  24,22.8 270 top
PWR  13.6,71.6 270 top
Q1  78.8,7.2 180 bottom
Q2  66.8,38.8 90 top
Q3  FDV304P  [SOT23']  58.8,66.8 90 top
Q4  65.2,19.6 180 top
Q5  79.3,8.21 0 top
Q6  FDV304P  [SOT23']  51.6,58.4 270 top
R1  75.2,62 270 bottom
R2  16,60 180 bottom
R3  82,20 270 top
R4  9.2,71.6 180 top
R5  84.4,20 90 top
R6  78.8,10.8 180 bottom
R7  25.6,36.8 180 top
R8  20.4,56.8 0 top
R9  72,53.6 180 top
R10  87.2,55.6 90 top
R11  82.4,50.8 90 top
R12  68.8,8 90 top
R13  66,8 90 top
R14  62,66.8 90 top
R15  65.2,22.8 0 top
R16  66.8,52.8 0 top
R17  66.8,55.2 180 top
R18  90.6,36.8 270 bottom
R19  88.4,36.8 270 bottom
R20  90.4,61.6 270 bottom
R21  88.2,61.6 270 bottom
R22  85.6,21.2 180 bottom
R23  87.2,28.4 180 bottom
R24  90.8,12.4 270 bottom
R25  88.4,12.4 270 bottom
R26  85.2,45.6 180 bottom
R27  85.2,52.8 0 bottom
R28  79.2,5.2 0 top
R29  58,26.4 90 top
R30  55.6,26.4 90 top
R31  24,25.2 180 top
R32  48.4,58.4 270 top
R33  25.2,18 90 bottom
R34  32,18 90 bottom
R35  32,55.6 270 bottom
R36  25.2,55.6 270 bottom
R37  56.8,20.8 90 top
R38  57.2,52.8 90 top
S1  7.4,13.6 0 top
SJ1  38,25.2 270 bottom
SJ2  72.4,58.4 90 top
SP1  74,19.2 0 top
STATUS  83.6,67.2 90 top
SW1  92.4,51.6 0 top
SW2  92.4,47.2 0 top
SW3  92.4,57.2 180 top
TP1  13.6,58.8 0 top
TP2  5.6,5.2 0 top
TP3  59.6,43.2 0 top
TP4  23.6,14.8 90 top
TP5  60.8,39.6 90 top
U1  58.42,58.42 0 top
U2  38,37.2 180 bottom
U$1  4,37 270 top

### Tracks (layer width: path | path; a pad name or v marks a point on that pad's centre or on a via)
+5V  (via drill 0.3, 0.6)
  Top 0.406: IC3.5 72.4,43.93 72.4,44.4 C12.1 | C14.1 | C13.1 | R13.2 R12.2 | R9.2 70,53.6 v69.6,54 | IC3.38 82.27,41.07 | C20.1 v53.6,39.2 | v55.6,29.6 53.89,29.6 IC9.14 | v52,47.6 C19.1 53.6,47.45 v53.6,46 | IC12.8 53.51,42.09 v53.6,42 | C14.1 85.01,43.39 | v92,42.4 87.6,42.4 v86,44 85.6,44 C14.1 | v88.4,30 v92,30 | v88,21.2 v92,21.2 | L1.1 v76.4,27.2 | 8.43,59.23 C4.+ 9.05,58.55 | 82.8,66.16 STATUS.2 82.56,66.4 83.2,66.4 83.6,66.8 83.6,67.6 83.99,67.99 STATUS.4 | 59.92,19.6 R37.3 | v58.4,51.6 58.45,51.65 R38.3 | v11.6,73.2 9.6,73.2 9.2,72.8 9.2,72.55 R4.2 | Q3.S 59.9,68.9 59.6,69.2 v58.8,69.2 | R32.2 Q6.S 50.75,57.2 v52,57.2
  Top 0.61: v18.4,11.6 v52,11.6 54.4,11.6 57.6,14.8 v59.6,14.8 v77.2,14.8 84.8,14.8 86.8,16.8 v92,16.8 | 74,62.4 v70,62.4 v62.4,62.4 v58.4,62.4 57.2,62.4 21.6,62.38 20.02,60.8 15.2,60.8 | 74,62.4 v82.8,62.4 | IC3.38 83.93,42.8 84.4,42.8 C14.1 | C13.1 70.8,31.2 71.2,31.2 IC3.17 75.2,35.2 75.2,38.07 76.73,39.6 | ISP.2 74.73,58.07 74,58.8 74,62.4 | R13.2 59.85,8.95 v59.6,9.2 | 82.27,41.07 80.8,39.6 76.73,39.6 | 76.73,39.6 IC3.5 | IC9.14 49.91,29.51 v49.6,29.2 | 13.6,60.8 v11.6,60.8 C3.1 9.05,58.55 | TP1.TP 13.6,60.8 | IC1.2 8.43,59.23 | v82.8,65.2 82.8,66.16 | v61.6,19.6 59.92,19.6 | 13.6,60.8 15.2,60.8 | v15.2,57.2 15.2,60.8 | v16.4,50.8 v13.6,53.6
  Bottom 0.3: R24.2 91.85,11.45 92,11.6 v92,16.8
  Bottom 0.406: v92,16.8 v92,21.2 v92,30 92,35.6 | 92,35.6 v92,42.4 92,53.6 | 90.55,60.8 R20.2 R21.2 | 92,35.6 91.75,35.85 R18.2 R19.2 | R24.2 R25.2 | v69.6,54 69.6,56.8 70,57.2 v70,62.4 | v55.6,29.6 53.6,31.6 v53.6,39.2 v53.6,42 v53.6,46 | v52,47.6 52,56.4 | 52,56.4 v52,57.2 | 82.8,55.6 v84,55.6 | 86,44.8 86.4,45.35 R26.2 | R22.2 v88,21.2 | v76.4,27.2 76.4,20.05 SP1.+ | v88.4,30 88,29.6 88,28.55 R23.2 | v58.4,51.6 58.4,54 56,56.4 52,56.4 | v58.8,69.2 58.8,62.8 v58.4,62.4
  Bottom 0.61: 90.55,60.8 91.6,60.8 92,60.4 92,53.6 88.8,53.6 88,54.4 84.8,54.4 84.4,54 | SP1.+ 77.25,14.85 v77.2,14.8 | v82.8,65.2 v82.8,62.4 82.8,55.6 84.25,53.75 R27.2 | v49.6,29.2 49.6,26 52,23.6 v52,11.6 | v18.4,11.6 18.4,13.6 18,14 18,20.4 15.6,22.8 15.6,48.8 16.4,49.6 v16.4,50.8 | v86,44 86,44.8 | BUS1.1 58.42,8.02 v59.6,9.2 v59.6,14.8 59.6,16 61.2,17.6 61.2,19.2 v61.6,19.6 | v11.6,60.8 v11.6,73.2 | v13.6,53.6 13.6,55.6 v15.2,57.2
AVCC
  Top 0.406: C5.1 81.35,26.75 L1.2 82,27.2 83.2,28.4 83.2,30.87 IC3.27
BUZZER  (via drill 0.3)
  Top 0.406: Q4.1 R15.2 66.15,25.45 v66,25.6 | IC3.14 70.21,33.6 v66,33.6
  Bottom 0.406: v66,33.6 v66,25.6
DIR_LA  (via drill 0.3)
  Top 0.406: IC3.22 75.6,29.94 v75.6,28.8 | v75.6,26.4 v60,26.4 | v52,34.6 53.79,34.6 IC9.10
  Bottom 0.406: v60,26.4 51.6,26.4 50.8,27.2 50.8,33.4 v52,34.6 | v75.6,28.8 v75.6,26.4
DIR_LB  (via drill 0.3)
  Top 0.406: v56.8,30.8 56.78,30.78 IC9.13 | v59.6,28 76,28 76.4,28.4 76.4,29.2 76.8,29.6 77.8,29.6 IC3.23
  Bottom 0.406: v59.6,28 v56.8,30.8
DIR_RA  (via drill 0.3)
  Top 0.406: IC3.13 69.88,34.4 v65.2,34.4 | v65.2,30.8 65.18,30.78 IC9.2
  Bottom 0.406: v65.2,34.4 v65.2,30.8
DIR_RB  (via drill 0.3)
  Top 0.406: IC3.21 74.8,30.27 v74.8,29.6 | v74.4,27.2 64,27.2 v63.6,27.2 | IC9.5 62.61,34.59 63.41,34.59 v63.6,34.4
  Bottom 0.406: v63.6,27.2 v63.6,34.4 | v74.8,29.6 74.8,27.6 v74.4,27.2
EN_ENCODER  (via drill 0.3)
  Top 0.406: v80,52.4 v74.4,52.4 | v73.2,61.6 49.2,61.6 48.4,60.8 R32.1 Q6.G | v79.2,46 79.2,44.86 IC3.44
  Bottom 0.406: v74.4,52.4 73.2,53.6 v73.2,61.6 | v80,52.4 80,48.8 79.2,48 v79.2,46
EN_UART  (via drill 0.3)
  Top 0.406: IC3.24 76,34.67 v76,34.8 | v63.6,66 62.15,66 R14.1 Q3.G | v70.8,63.2 v63.6,63.2
  Bottom 0.406: v76,34.8 76,38.8 70.4,44.4 70.4,56 70.8,56.4 v70.8,63.2 | v63.6,63.2 v63.6,66 63.6,68.8 62.4,70 62.4,72.8 59.2,72.8 58.42,72.02 BUS2.1
ENC_LEFT  (via drill 0.3)
  Top 0.406: IC3.11 69.27,38.87 v69.2,38.8 | v61.2,42 59.6,42 | 59.6,42 57.09,42 IC12.1 | TP3.TP 59.6,42
  Bottom 0.406: v69.2,38.8 64.4,38.8 v61.2,42
ENC_RIGHT  (via drill 0.3)
  Top 0.406: IC3.12 70.67,36.27 70,35.6 65.6,35.6 65.2,36 v62,36 | IC12.7 53.44,43.37 55.6,41.2 60,41.2 60.8,40.4 TP5.TP v60.8,38.4
  Bottom 0.406: v62,36 62,37.2 v60.8,38.4
GND  (via drill 0.3, 0.6)
  Top 0.406: 17.7,68.4 C1.- | 8.2,56 C4.- | IC3.6 72,43.2 71.2,43.2 C12.2 | C14.2 84.4,45.2 84.8,45.2 85.2,44.8 v96.4,44.8 96.4,48 | 71.4,29.8 C13.2 | SJ2.2 v72.4,60.8 | Q4.2 R15.1 | R28.2 80.25,5.3 Q5.2 81.11,7.11 v82,8 | 84.6,29.4 C11.2 84,29.2 v84,28.8 | 60,37.19 IC9.7 | C19.2 56.4,47.6 57.2,46.8 57.2,46.1 IC12.4 | v32.4,15.2 30.71,16.89 IC10.4 29.18,16.89 IC10.1 | v84.8,49.6 94.45,49.6 SW2.1 96.4,48 | C5.2 v75.6,24 | 11.75,56.8 C3.2 | 96.4,48 96.4,52.8 v95.6,53.6 94.8,53.6 94.4,53.2 94.4,52.45 SW1.1 | SW3.4 94.45,57.95 95.6,56.8 v95.6,56.4 | 60.4,53.84 60.4,53.6 60.05,53.95 R38.1 | 6,62.71 IC1.1 | R14.2 62,68.8 61.6,69.2 v60.8,69.2
  Top 0.61: C2.2 13.2,66 15.6,68.4 17.7,68.4 | v19.6,10.4 v32.4,10.4 v38,10.4 55.2,10.4 57.6,12.8 v67.2,12.8 v75.6,12.8 v82,12.8 | v20,64 v60.8,64 v72.4,64 v80.4,64 83.2,64 v84,64.8 | IC3.39 v82.8,42.8 | v82.8,42.8 83.2,43.2 83.2,44 C14.2 | IC3.18 71.6,30.47 71.6,30 71.4,29.8 | C13.2 70.8,28.8 v67.2,28.8 | C12.2 70,44.4 v69.6,44.4 | R15.1 64.25,24.65 v64.4,24.8 63.75,25.45 59.6,25.45 | v82.8,42.8 80.4,40.4 v78.4,40.4 | v79.4,35.6 79.6,35.6 IC3.28 84.3,30.9 84.3,30.1 C11.2 | C20.2 v59.2,39.2 60,38.4 60,37.19 63.59,37.19 64,37.6 C10.2 | R30.1 R29.1 59.6,25.45 | C8.2 v69.6,51.2 v61.6,51.2 61.6,53.6 60.88,54.32 | IC12.4 58.49,45.91 v59.2,45.2 | v27.2,55.6 v19.6,55.6 14,55.6 12.8,56.8 11.75,56.8 | U1.3 60.96,54.4 60.88,54.32 | R37.1 59.55,24.6 59.6,25.45 | v61.6,47.2 60,47.2 59.2,46.4 v59.2,45.2 | C9.2 60.05,44.35 v59.2,45.2 | C3.2 10.25,56.65 9.6,56 C4.- 6.8,56 6,56.8 v6,59.6 6,62.71 | 60.88,54.32 60.4,53.84 | PWR.C 19.2,71.6 20,70.8 v20,70 18.4,70 18,69.6 C1.- | TP2.TP 5.6,3.6 6.4,2.8 7.6,2.8 8.8,1.6 20.8,1.6 21.6,2.4 21.6,4.8 20.4,6 18.07,6 J1.1 | v19.6,8 19.2,8 18,6.8 J1.1 | J1.1 15.27,6.07 v15.2,6 | v94.8,18.8 84.65,18.8 R5.1 v84.4,17.6
  Bottom 0.406: v72.4,64 v72.39,64.01 | 84.4,63.5 IC5.4 | v95.6,56.4 v95.6,53.6 | v32.4,15.2 v32.4,10.4 | 27.2,56.92 IC11.4 | IC8.4 84.3,50.1 v84.8,49.6 | IC4.4 84.3,41.3 v82.8,42.8 | IC6.4 84.3,28.5 v84,28.8 | R6.2 Q1.2 81.7,8.3 v82,8 v82,12.8 83.4,14.2 IC7.4 84.3,17.5 v84.4,17.6 | v60.8,69.2 v60.8,64
  Bottom 0.61: v20,70 v20,64 20,57.2 19.6,56.8 v19.6,55.6 v19.6,10.4 v19.6,8 | SJ1.2 v38,10.4 | U1.3 60.96,63.84 v60.8,64 | ISP.6 80.54,63.86 v80.4,64 80.4,64.8 76.2,69 BUS2.8 | v72.4,60.8 v72.4,64 | v67.2,28.8 67.2,24.8 | 67.2,24.8 v67.2,12.8 | v69.6,44.4 v69.6,51.2 | v61.6,47.2 v61.6,51.2 | v64.4,24.8 67.2,24.8 | v78.4,40.4 78.4,36.6 v79.4,35.6 | v96.4,44.8 96.4,40 95.2,38.8 95.2,19.6 v94.8,18.8 | v84,64.8 84.4,64.4 84.4,63.5 | v59.2,39.2 v59.2,45.2 | v27.2,55.6 27.2,56.92 | IC11.4 28.02,57.11 IC11.1 | v75.6,24 v75.6,12.8 76.2,12.2 BUS1.8 | JP1.2 5.93,59.67 v6,59.6
  other vias: 4,28.8 4,45.6 36,22.4 41.2,22.4 36,15.2 41.2,15.2 37.2,52 42,52 54,15.2 58.4,48 77.2,41.6 73.2,37.6 77.6,46.4 97.2,29.6 97.6,41.6 84.8,6.4 48.4,15.2 42,58.4 37.2,58.4 9.2,48 4.4,20.8 58,10.4 67.2,30.4 46.8,29.6 46.8,36.8 57.6,33.6 4,37.2 4,68.4 13.6,69.6 10.8,53.2 3.2,62 17.2,30 17.6,41.6
  pour Bottom (rank 2): 0,0 24,0 24,9.2 56,9.2 56,0 99.2,0 99.2,70 99.2,74 56,74 56,64.8 24,64.8 24,74 0.4,74 0,74
  pour Top (rank 2): 0,0 24,0 24,9.2 56,9.2 56,0 99.2,0 99.2,74 56,74 56,64.8 24,64.8 24,74 0,74
GND1  (via drill 0.3, 0.6)
  Top 0.406: C6.2 22,45.2 | 22,45.2 23.6,46.8 C7.- | v18,45.2 22,45.2 | R8.3 19.25,53.25 v18,52
  Top 0.61: v28.8,47.2 24.8,47.2 C7.- | v38,30.8 36.4,30.8 33.6,28 29.6,28 28.8,28.8
  Bottom 0.406: U2.6 37.03,38.16 U2.17 | U2.13 38.33,36.87 U2.17 | U2.17 38,36.4 37.84,36.23 U2.3 | 40.8,47.2 C15.2 | v18,52 v18,45.2
  Bottom 0.61: SJ1.1 v38,30.8 | v28.8,30.8 v28.8,47.2 40.8,47.2 | 38,36.4 v38,30.8 | v38,30.8 42.4,30.8 | 42.4,30.8 43.4,30.8 C18.2 | C15.2 42.75,47 C16.2 | v42.4,29.2 42.4,30.8
  other vias: 36.8,45.2 36.4,32 30,37.2 34,45.2 43.6,42.4 22.8,43.6
  pour Bottom (no thermals): 20,48.4 20,26.4 45.6,26 45.6,48.4
  pour Top: 20,48.4 20,26.4 45.6,26 45.6,48.4
LED_BOTTOM  (via drill 0.3)
  Top 0.406: IC3.25 81.2,30.61 v81.2,30
  Bottom 0.406: v81.2,30 81.2,16 78,12.8 78,10.95 R6.1 Q1.1
LED_GREEN  (via drill 0.3)
  Top 0.406: IC3.41 81.6,43.86 v81.6,45.6 | v81.6,54 86.55,54 R10.1
  Bottom 0.406: v81.6,45.6 v81.6,54
LED_RED  (via drill 0.3)
  Top 0.406: IC3.40 82.4,43.53 v82.4,44.8 | v82.4,48.4 R11.1
  Bottom 0.406: v82.4,44.8 v82.4,48.4
LINE_C  (via drill 0.3)
  Top 0.406: IC3.32 85.33,34.4 89.6,34.4 90.4,35.2 v90.4,39.2 89.6,40 86.8,40 86,39.2 v86,36.8
  Bottom 0.406: v90.4,39.2 90.6,39 R18.1 | IC4.3 84.4,35.2 v86,36.8
LINE_CL  (via drill 0.3)
  Top 0.406: IC3.33 85.26,35.6 87.6,35.6 88.4,36.4 v88.4,39.2
  Bottom 0.406: IC8.3 84.3,45.65 R26.1 84.4,45.45 84.4,42.8 88,39.2 v88.4,39.2
LINE_CR  (via drill 0.3)
  Top 0.406: IC3.31 84.99,33.6 v90.8,33.6 | v86,17.6 v90.8,17.6
  Bottom 0.406: v90.8,33.6 v90.8,17.6 R24.1 | IC7.3 84.3,11.9 85.2,12.8 85.2,16.8 v86,17.6
LINE_L  (via drill 0.3)
  Top 0.406: IC3.34 84.53,38.93 86.4,40.8 v95.6,40.8 | v96.4,54.4 90.4,54.4 88.4,56.4 88.4,57.6 88,58 v84.4,58 | v84.4,61.6 v92,61.6
  Bottom 0.406: v95.6,40.8 95.6,51.2 96.4,52 v96.4,54.4 | v84.4,58 84.3,58.1 IC5.3 84.3,61.5 v84.4,61.6 | v92,61.6 92,62.4 91.6,62.8 90.65,62.8 R20.1
LINE_PWR  (via drill 0.3)
  Top 0.406: R28.1 78.35,5.3 Q5.1 77.69,7.11 77.2,7.6 77.2,10 77.6,10.4 v81.2,10.4 | IC3.26 82,30.94 v82,30.8
  Bottom 0.406: v82,30.8 82,15.6 81.2,14.8 v81.2,10.4
LINE_R  (via drill 0.3)
  Top 0.406: IC3.30 84.66,32.8 v90,32.8 | v90,24.8 84.4,24.8 v84,24.4
  Bottom 0.406: v90,32.8 v90,24.8 | v84,24.4 84,23.3 IC6.3 84.3,21.55 R22.1
MISO  (via drill 0.3)
  Top 0.406: IC3.2 74.8,44.92 v74.8,48.4 | v74,66.4 69.2,66.4 v68.8,66.8
  Bottom 0.406: v74.8,48.4 75.46,49.34 ISP.1 74,56.99 v74,66.4 | v68.8,66.8 68.8,70.9 BUS2.5
MOSI  (via drill 0.3)
  Top 0.406: IC3.1 75.6,45.26 v75.6,46.8 | v78,65.6 v66.4,65.6
  Bottom 0.406: v75.6,46.8 79.2,50.4 79.2,57.2 78.4,58 78.07,58 ISP.4 v78,65.6 | v66.4,65.6 66,66 66,71.08 BUS2.4
MOTL_PWM  (via drill 0.3)
  Top 0.305: v64.4,35.2 56.4,35.2
  Top 0.406: IC3.16 70.87,32 v64.4,32 | IC9.9 55.74,35.86 56.4,35.2 56.4,32.4 56.05,32.05 IC9.12 52.05,32.05 v52,32 | R30.2 55.45,27.2 v52,27.2
  Bottom 0.406: v64.4,32 v64.4,35.2 | v52,27.2 v52,32
MOTR_PWM  (via drill 0.3)
  Top 0.406: IC3.15 70.54,32.8 v62.8,32.8 62.28,33.32 IC9.4 | IC9.1 60.03,29.6 v62.4,29.6 | R29.2 59.05,27.35 59.2,27.2 v62.4,27.2
  Bottom 0.406: v62.8,32.8 62.8,30 v62.4,29.6 v62.4,27.2
N$1
  Top 0.61: J2.1 J1.2
N$3
  Top 0.61: PWR.A R4.1
N$4  (via drill 0.3)
  Top 0.3: v93.2,59.6 92.88,59.28 85.52,59.28 v85.2,59.6
  Top 0.406: Q5.3 85.89,9.31 v86,9.2 | v91.2,34.4 v94.4,34.4 | v87.6,43.6 v94.4,43.6 | v87.2,22.8 v94.4,22.8
  Bottom 0.254: IC7.2 86.1,11.7 87.2,12.8 87.2,18.4 88.8,20 88.8,22.4 88.4,22.8 v87.2,22.8
  Bottom 0.3: IC5.2 85.9,59.6 v85.2,59.6
  Bottom 0.406: v94.4,22.8 v94.4,34.4 v94.4,43.6 94.4,58.4 v93.2,59.6 | IC4.2 86.4,35.2 87.2,34.4 v91.2,34.4 | IC8.2 87.4,47.4 87.6,47.2 v87.6,43.6 | IC6.2 87,23 v87.2,22.8 | IC7.2 86.1,9.3 v86,9.2
N$5
  Top 0.406: SP1.- 70.05,18.5 Q4.3
N$6  (via drill 0.3)
  Top 0.406: R10.2 85.85,56.55 v85.6,56.8 | v86.8,66.4 85.46,66.4 STATUS.1
  Bottom 0.406: v85.6,56.8 85.6,57.6 86.8,58.8 v86.8,66.4
N$7
  Bottom 0.406: U2.14 42.97,36.23 43.6,35.6 C18.1
N$8  (via drill 0.3)
  Top 0.61: v43.6,40.4 v43.6,37.8
  Bottom 0.406: U2.11 43.23,38.16 v43.6,37.8
  Bottom 0.61: C17.2 40,41.2 40.8,40.4 v43.6,40.4
N$9
  Bottom 0.406: IC11.3 30.49,57.11 31.2,56.4 31.85,56.4 R35.1
N$10  (via drill 0.3)
  Top 0.406: v85.6,64.8 88,64.8 v88.4,64.4
  Bottom 0.406: IC5.1 86.1,64.3 v85.6,64.8 | v88.4,64.4 88.2,64.2 R21.1
N$11
  Top 0.61: S1.2 7.4,11 10.8,7.6 J2.2
  Bottom 0.61: JP1.1 2,19.6 5.2,16.4 7,16.4 7.4,16 S1.2
N$12  (via drill 0.3)
  Top 0.406: IC11.2 27.41,59.02 28.4,60 v45.2,60 | IC12.3 55.77,44.63 v55.2,45.2 | v55.2,50 50,50 49.6,49.6 v45.2,49.6
  Bottom 0.406: R36.1 25.2,58 26,58.8 27.18,58.8 IC11.2 | v45.2,60 v45.2,49.6 | v55.2,45.2 v55.2,50
N$13  (via drill 0.3)
  Top 0.406: v78.8,3.6 77.6,3.6 v75.2,6 | v14.8,20 23.2,20 24.8,18.4 62,18.4 62.4,18.8 62.4,19.2 62.8,19.6 68,19.6 69.6,21.2 72.8,21.2 v74,20
  Bottom 0.406: Q1.3 v78.8,3.6 | v75.2,6 LED3.C 74,6.15 v74,20 | v14.8,20 14.8,12.15 LED4.C
N$14
  Bottom 0.406: IC10.3 25.36,16.89 R33.1
N$15
  Top 0.406: C11.1
  Top 0.61: IC3.29 84.73,31.6 85.2,31.6 C11.1
N$16
  Bottom 0.406: U2.5 34.07,37.53 32.8,38.8 31.6,38.8 30.4,40 30.4,43.08 U$1.3
N$17
  Top 0.406: R17.1 71.6,55.2 72.4,56 SJ2.1
N$18  (via drill 0.3)
  Top 0.406: R11.2 v82.4,53.2 | v81.6,65.06 81.34,65.06 80.8,65.6 80.8,67.6 81.2,68 82.54,68 STATUS.3
  Bottom 0.406: v82.4,53.2 82.4,54.4 82,54.8 82,64 81.6,64.4 v81.6,65.06
N$20  (via drill 0.3)
  Top 0.406: Q3.D 57.7,65.7 v57.6,65.6
  Bottom 0.406: v57.6,65.6 57.6,60.8 58.4,60 58.4,58.44 U1.2
N$21
  Top 0.406: MOT_FLT.A 22.95,25.1 R31.2
N$22  (via drill 0.3)
  Top 0.406: v34.8,40.4 34.4,40.4 32.8,38.8 v27.2,38.8 | MOT_FLT.C 26,22.8 v26.4,23.2
  Bottom 0.406: U2.8 35.08,40.12 v34.8,40.4 | v26.4,23.2 26.4,28.8 27.2,29.6 v27.2,38.8
N$23  (via drill 0.3)
  Top 0.406: IC9.3 59.89,32 58.4,32 58,31.6 58,28.8 57.6,28.4 53.6,28.4 53.2,28 43.2,28 41.6,28 40.8,28.8 v40.8,32.4
  Bottom 0.406: v40.8,32.4 40.8,34.79 U2.16
N$24  (via drill 0.3)
  Top 0.406: v42.4,35.2 48,35.2 50.8,38 56.4,38 58.54,35.86 IC9.6
  Bottom 0.406: U2.15 42.03,35.57 v42.4,35.2
N$25  (via drill 0.3)
  Top 0.406: v46.4,38.8 v50.4,38.8 | v50.4,34.4 51.6,33.2 53.68,33.2 IC9.11
  Bottom 0.406: U2.10 46.37,38.83 v46.4,38.8 | v50.4,38.8 v50.4,34.4
N$26  (via drill 0.3)
  Top 0.406: v52,37.2 53.73,37.2 IC9.8 | v47.2,39.6 v52,39.6
  Bottom 0.406: U2.9 47.09,39.49 v47.2,39.6 | v52,39.6 v52,37.2
N$27
  Top 0.406: IC3.7 71.67,42.4 70.4,42.4 69.2,43.6 64.8,43.6 63.6,44.8 Q2.P$3 63.45,46.05 C9.1
N$28
  Top 0.406: IC3.8 71.34,41.6 66.8,41.6 66.4,41.2 66.4,40.2 Q2.P$1 66.45,39.55 C10.1
N$29
  Bottom 0.406: LED1.A 74.8,68 75.2,67.6 R1.1
N$30  (via drill 0.3)
  Top 0.406: v70.8,23.6 v68.8,25.6 | v59.6,64.8 64.4,64.8 67.6,68 70.4,68 v71.6,69.2
  Bottom 0.406: LED3.A 71.75,11.45 71.2,12 71.2,16.8 72.4,18 72.4,22 v70.8,23.6 | v68.8,25.6 68.8,36.8 68,37.6 63.2,37.6 60.4,40.4 60.4,55.6 59.6,56.4 v59.6,64.8 | v71.6,69.2 71.6,68.15 LED1.C
N$31  (via drill 0.3)
  Top 0.406: v33.6,17.2 v46,17.2 | IC12.5 50.09,45.91 v50,46 | TP4.TP 24.4,14.8 25.6,13.6 29.6,13.6 30,14 30,14.79 IC10.2
  Bottom 0.406: IC10.2 30.98,14.98 32,16 R34.1 33.45,17.05 v33.6,17.2 | v46,17.2 46,23.6 48,25.6 48,31.6 48.8,32.4 48.8,44.8 v50,46
N$32
  Bottom 0.406: LED4.A 17.2,12.15 17.2,13.6 16.4,14.4 16.4,20.4 14.4,22.4 14.4,50.4 18.4,54.4 18.4,61.6 18,62 LED2.C
N$33
  Bottom 0.406: R2.1 14.95,60 LED2.A
N$35  (via drill 0.3)
  Top 0.406: 26.66,36.69 R7.1 26.55,37.85 26,38.4 26,39.6 v26.4,40 | v26.4,52 22.4,52 21.6,52.8 21.6,54 R8.1 22.75,54.05 v22.8,54 | v22.4,59.6 20.45,59.6 R8.2
  Top 0.61: IC2.1 26.66,36.69
  Bottom 0.406: v26.4,40 v26.4,52 | v22.8,54 22.8,59.2 v22.4,59.6
N$36  (via drill 0.3)
  Top 0.406: IC12.6 50.23,44.63 v49.6,44 | v51.2,23.2 52.8,23.2 54,22 54,22.05 R37.2
  Bottom 0.406: v49.6,44 49.6,32 48.8,31.2 48.8,25.6 v51.2,23.2
N$37
  Bottom 0.406: IC4.1 87.35,38.8 R19.1
N$38
  Bottom 0.406: U2.7 33.97,38.83 33.6,39.2 33.6,41.6 33.2,42 32.02,42 U$1.4
N$39
  Bottom 0.406: U2.4 32.47,36.87 31.94,36.34 U$1.2
N$40
  Bottom 0.406: IC6.1 86.1,28.35 R23.1
N$41
  Bottom 0.406: U2.2 33.97,35.57 33.2,34.8 33.2,30.64 U$1.1
N$42  (via drill 0.3)
  Top 0.406: v88.2,15 v86,12.8
  Bottom 0.406: R25.1 88.4,14.8 v88.2,15 | v86,12.8 86,14.1 IC7.1
N$43
  Bottom 0.406: IC8.1 86.1,52.75 R27.1
N$44  (via drill 0.3)
  Top 0.406: IC12.2 55.44,43.37 v54.4,44.4 | v54.4,50.8 54.45,51.65 R38.2
  Bottom 0.406: v54.4,44.4 v54.4,50.8
N$47  (via drill 0.3)
  Top 0.406: v34,54.8 35.2,56 52.4,56 52.8,56.4 52.8,58.3 Q6.D
  Bottom 0.406: v34,54.8 32.15,54.8 R35.2 R36.2 25.2,41.6 22.4,38.8 22.4,22.8 25.2,20 R33.2 R34.2 25.45,18.95 25.2,19.2
PA0/ADC0  (via drill 0.3)
  Top 0.406: IC3.37 78.4,36.14 v78.4,34 | v77.6,25.2 77.2,24.8 v73.2,24.8
  Bottom 0.406: v78.4,34 77.6,33.2 v77.6,25.2 | v73.2,24.8 73.2,7.6 72.8,7.2 72.8,4.8 71.2,3.2 71.2,2.62 BUS1.6
PA1/ADC1  (via drill 0.3)
  Top 0.406: IC3.36 84.99,41.6 v92.8,41.6 | v92.8,16 87.6,16 83.6,12 v74.8,12 | v74.8,7.6 74.8,6.8 73.6,5.6 73.6,2.6 BUS1.7
  Bottom 0.406: v92.8,41.6 v92.8,16 | v74.8,12 v74.8,7.6
RESET  (via drill 0.3)
  Top 0.406: IC3.4 v73.2,44.26 | v74.4,51.2 C8.1 R9.1 78.61,53.6 ISP.5 82.73,55.53 83.6,56.4 83.6,58.4 84,58.8 88.8,58.8 89.2,58.4 89.2,56.8 89.6,56.4 SW3.1 | v35.2,33.6 v48,33.6 | v48,48.4 49.6,48.4 50.4,49.2 60.8,49.2 62,48 v64.8,48 v73.2,48 | BUS2.2 60.96,72.16 61.6,72.8 64.8,72.8 64.8,67.2 v64.4,66.8
  Bottom 0.406: v73.2,44.26 v73.2,48 73.2,50 v74.4,51.2 | U2.1 35.08,33.72 v35.2,33.6 | v48,33.6 v48,48.4 | v64.4,66.8 64.4,60 64.8,59.6 v64.8,48
RXD  (via drill 0.3)
  Top 0.406: IC3.9 71.01,40.8 v68,40.8 | v68.8,60.8 64,60.8 63.6,60.4 63.6,58.52 U1.4 | v68,42.8 v63.6,42.8
  Bottom 0.406: BUS2.6 71.12,69.92 70,68.8 70,64.8 68.8,63.6 v68.8,60.8 | v68,40.8 v68,42.8 | v63.6,42.8 63.6,58.32 U1.4
SCK  (via drill 0.3)
  Top 0.406: IC3.3 74,44.59 v74,46.4 | 63.6,71.02 BUS2.3 | v76.8,64.8 v65.6,64.8
  Bottom 0.406: v74,46.4 78,50.4 ISP.3 76.8,56.73 v76.8,64.8 | v65.6,64.8 65.2,65.2 65.2,69.2 64,70.4 64,70.62 BUS2.3
SCL  (via drill 0.3)
  Top 0.406: v73.2,30.8 73.2,30.94 IC3.19 | R13.1 66,6.4 66.04,6.36 | 66.04,6.36 66.8,5.6 v67.2,5.6 67.31,5.6 | BUS1.4 66.04,6.36
  Bottom 0.406: v67.2,5.6 67.2,10.8 68.4,12 68.4,24 73.2,28.4 v73.2,30.8
SDA  (via drill 0.3)
  Top 0.406: v74,30.4 74,30.61 IC3.20 | v70.4,7.6 69.35,7.6 R12.1 68.58,6.83 BUS1.5
  Bottom 0.406: v70.4,7.6 70.4,16.4 69.2,17.6 69.2,23.6 74,28 v74,30.4
START  (via drill 0.3)
  Top 0.406: v64.8,11.2 90.4,11.2 v93.6,14.4 | v92.8,50.8 SW1.4 84.8,50.8 84,50 84,48 83.6,47.6 81.2,47.6 v80.8,47.2 | IC3.42 80.8,44.19 v80.8,45.2
  Bottom 0.406: 64.77,11.17 v64.8,11.2 63.5,9.9 BUS1.3 | v93.6,14.4 93.6,50 v92.8,50.8 | v80.8,45.2 v80.8,47.2
TXD  (via drill 0.3)
  Top 0.406: v69.2,52.8 R16.2 | IC3.10 70.67,40 v68.8,40 | BUS2.7 73.66,71.94 72.8,72.8 v67.2,72.8
  Bottom 0.406: v68.8,40 68.8,52.4 | 68.8,52.4 v69.2,52.8 | v67.2,72.8 67.2,53.35 R16.2 68.4,52.8 68.8,52.4
TXD_3V3
  Top 0.406: R16.1 R17.2 65.85,58.37 U1.5
USER
  Top 0.406: IC3.43 80,44.52 80,46 80.4,46.4 SW2.4
V+  (via drill 0.3)
  Top 0.406: 10.8,62.94 IC1.3 | 13.09,62.94 C2.1 | 18,64.4 C1.+ | v75.6,59.6 76,59.6 76.8,58.8 v76.8,54.4 | 22.09,36.56 C6.1
  Top 0.61: 13.09,62.94 10.8,62.94 10.8,64.8 10,65.6 5.2,65.6 4.4,64.8 v4.4,52.8 | C2.1 17.75,63.05 C1.+ | R3.2 82,16.8 81.2,16 v60.8,16 57.2,16 54,12.8 12,12.8 11.2,13.6 S1.3 | v76.4,50 76,49.6 62,49.6 61.6,50 57.6,50 56.4,51.2 56.4,53.6 55.6,54.4 36,54.4 32,49.6 v12.8,49.6 | 22.09,36.56 IC2.3 16.85,34.35 v12.8,34.4
  Bottom 0.406: 60.96,16.16 v60.8,16 | R1.2 74.8,60.65 74.8,60.4 v75.6,59.6
  Bottom 0.61: 12.8,51.2 v12.8,49.6 v12.8,34.4 12.8,18.4 10,15.6 10,13.66 S1.3 | 12.8,51.2 6,51.2 v4.4,52.8 | BUS1.2 60.96,16.16 | R2.2 16.8,59.85 16.8,55.2 12.8,51.2 | v76.8,54.4 76.8,50.4 v76.4,50
VBAT  (via drill 0.3)
  Top 0.406: IC3.35 82.8,38.27 v82.8,38 | R5.2 R3.1 80.55,20.95 v80.4,20.8
  Bottom 0.406: v82.8,38 80.4,35.6 v80.4,20.8
VPP  (via drill 0.6)
  Top 0.406: 24.8,36.95 R7.2 | 24.65,34.62 IC2.2 24.4,34.32 24.4,32.8 27.2,30 27.2,26.4 26,25.2 R31.1
  Top 0.61: v44.8,36.8 v44.8,44.4 | 24.8,36.95 C7.+ 28.8,42 30,43.2 30,45.6 30.8,46.4 34.8,46.4 35.6,45.6 v35.6,44 | R7.2 24.65,34.62
  Bottom 0.406: U2.12 42.47,37.53 43.2,36.8 v44.8,36.8 | 43.45,44.4 C16.1 | 41.25,44.65 C15.1
  Bottom 0.61: v44.8,44.4 43.45,44.4 | C16.1 41.25,44.65 | C15.1 36.8,44.2 | 36.8,44.2 36.2,44.2 v35.6,44 | C17.1 37.05,43.95 36.8,44.2

### Text on the board
tPlace: 1 | 8 | EN | 1 | GND
bPlace: SCK | MOSI | MISO | EN_UART | RESET | RXD | TXD | BUS2 | GND | ADC0 | U_BATT | START | ADC1 | +5V | SCL | SDA | GND
tNames: GND | HC-06 Bluetooth | RESET | V+ | START | USER | Speedy Bot V2.1 / Michael Schreiber / Dezember 2019 | OFF/ON